# EAGLE design AJH_module_tester-v02_11 (EAGLE 9.5.2)

## Sheet 1 of 4
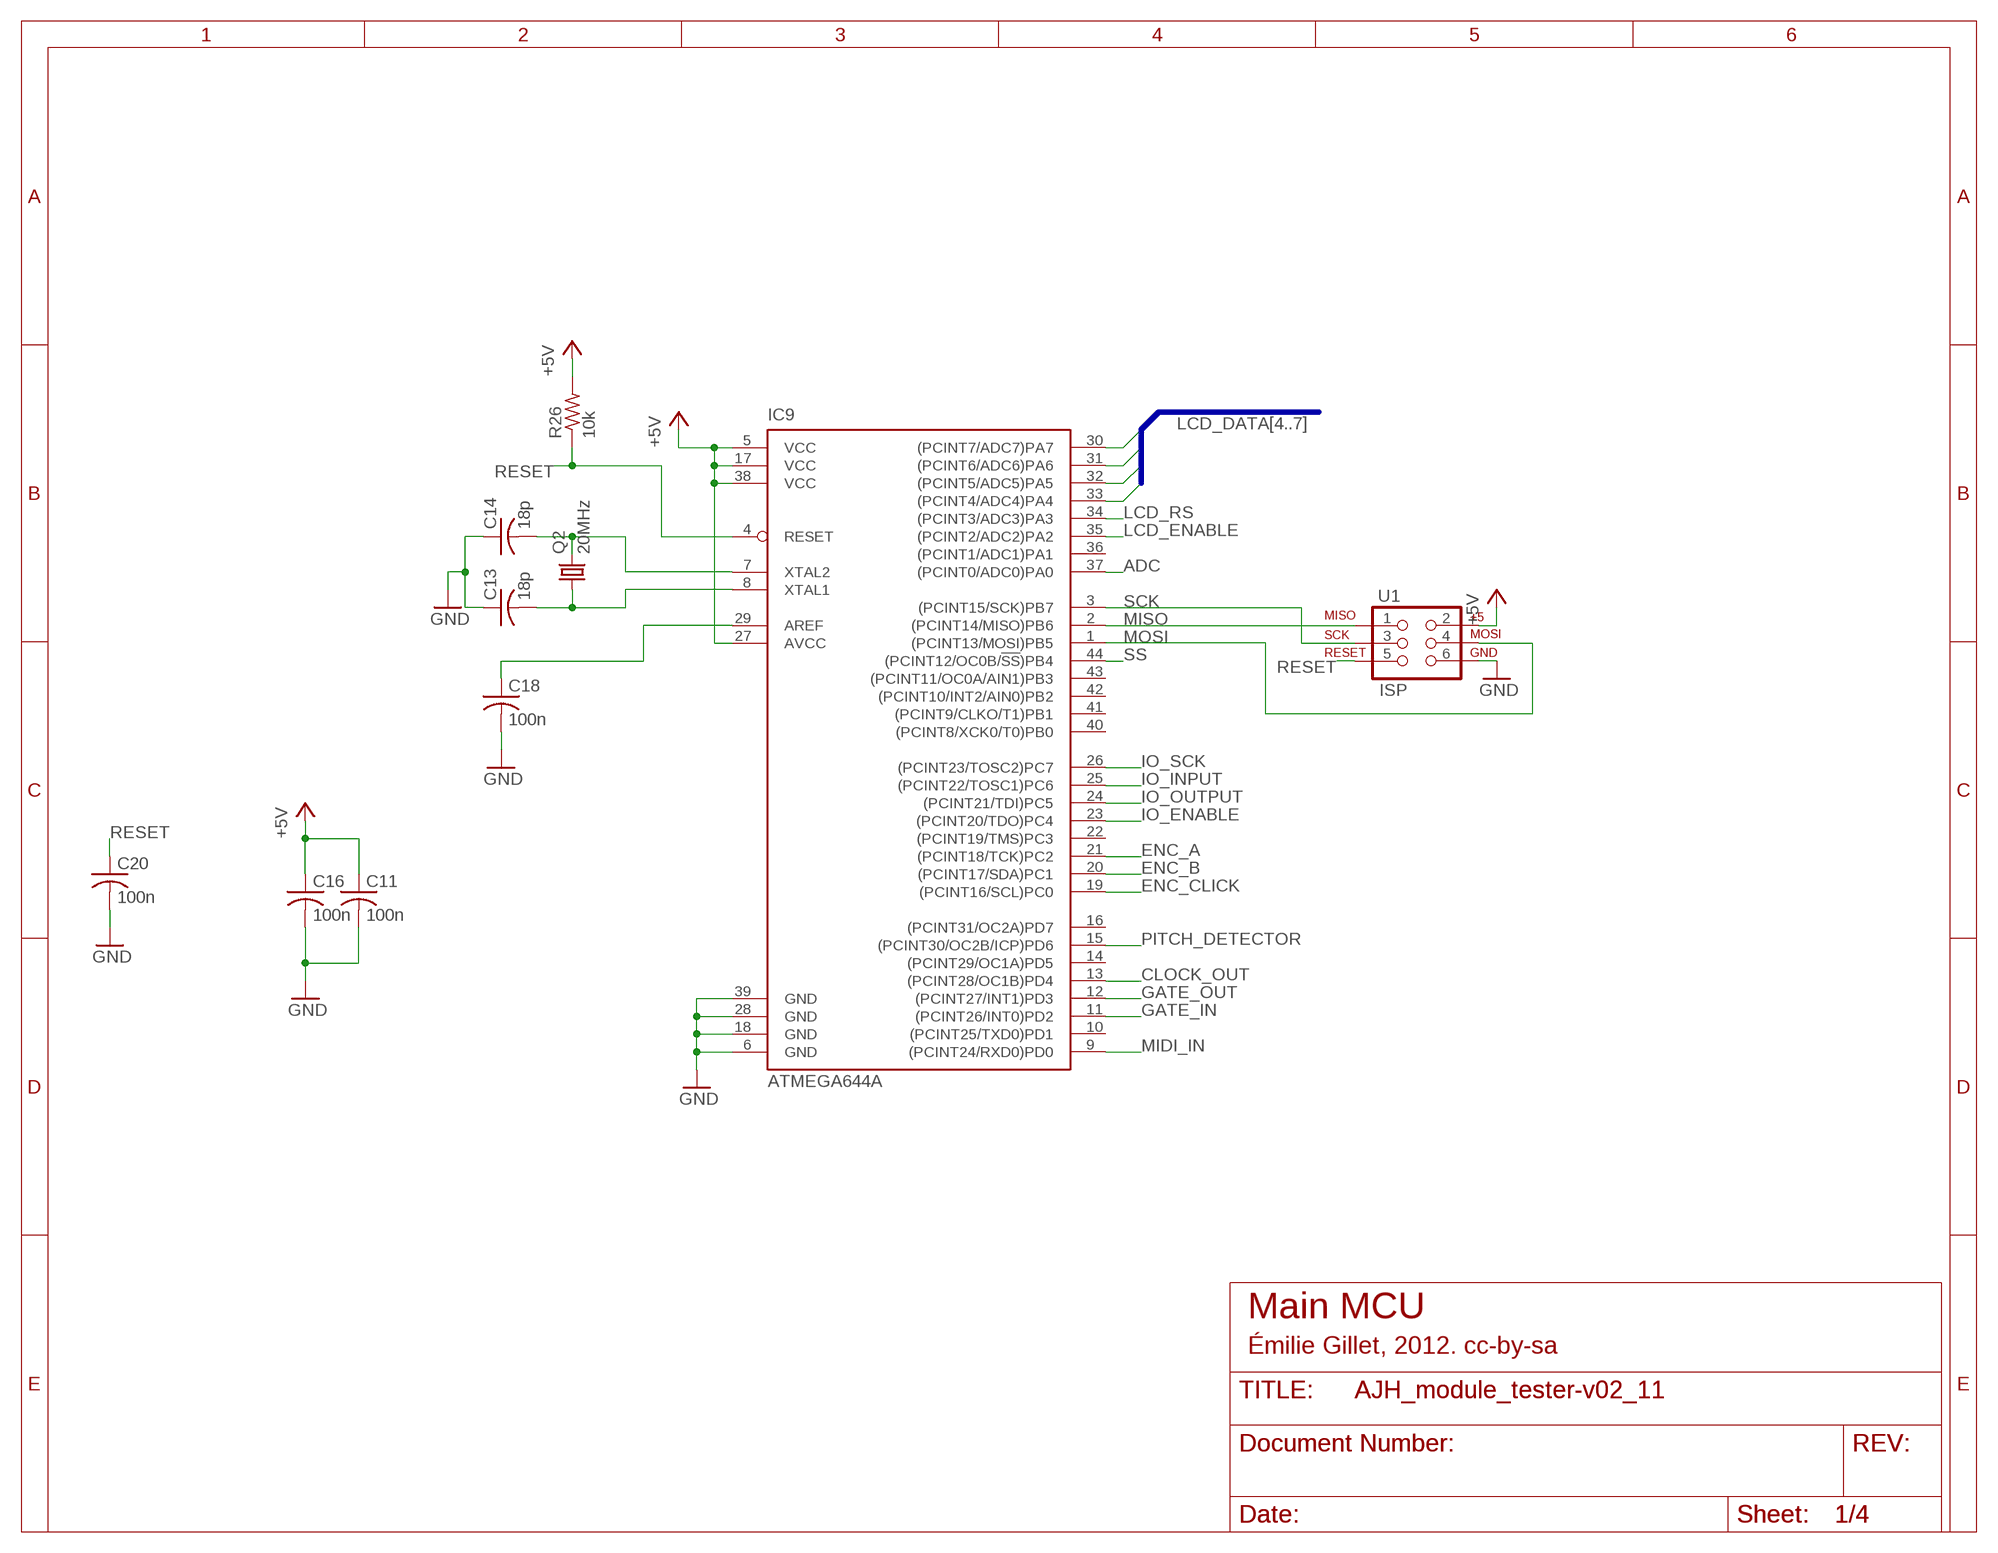
[diagram p0: schematic, sheet 1]

### Parts
C11  100n  C-USC0603  [C0603]
C13  18p  C-USC0603  [C0603]
C14  18p  C-USC0603  [C0603]
C16  100n  C-USC0603  [C0603]
C18  100n  C-USC0603  [C0603]
C20  100n  C-USC0603  [C0603]
IC9  ATMEGA644A  [TQFP44]
Q2  20MHz  CRYSTALHC49UP  [HC49UP]
R26  10k  R-US_R0603  [R0603]
U1  ISP  AVR_SPI_PRG_6PTH  [2X3]

### Nets
+5V: C11.1 C16.1 IC9.5(VCC) IC9.17(VCC) IC9.27(AVCC) IC9.38(VCC) R26.2 U1.2 ; also sheet 2,3,4
ADC: IC9.37((PCINT0/ADC0)PA0) ; also sheet 3
CLOCK_OUT: IC9.13((PCINT28/OC1B)PD4) ; also sheet 2
ENC_A: IC9.21((PCINT18/TCK)PC2) ; also sheet 2
ENC_B: IC9.20((PCINT17/SDA)PC1) ; also sheet 2
ENC_CLICK: IC9.19((PCINT16/SCL)PC0) ; also sheet 2
GATE_IN: IC9.11((PCINT26/INT0)PD2) ; also sheet 2
GATE_OUT: IC9.12((PCINT27/INT1)PD3) ; also sheet 2
GND: C11.2 C13.1 C14.1 C16.2 C18.2 C20.2 IC9.6(GND) IC9.18(GND) IC9.28(GND) IC9.39(GND) U1.6 ; also sheet 2,3,4
IO_ENABLE: IC9.23((PCINT20/TDO)PC4) ; also sheet 2
IO_INPUT: IC9.25((PCINT22/TOSC1)PC6) ; also sheet 2
IO_OUTPUT: IC9.24((PCINT21/TDI)PC5) ; also sheet 2
IO_SCK: IC9.26((PCINT23/TOSC2)PC7) ; also sheet 2
LCD_DATA4: IC9.33((PCINT4/ADC4)PA4) ; also sheet 2
LCD_DATA5: IC9.32((PCINT5/ADC5)PA5) ; also sheet 2
LCD_DATA6: IC9.31((PCINT6/ADC6)PA6) ; also sheet 2
LCD_DATA7: IC9.30((PCINT7/ADC7)PA7) ; also sheet 2
LCD_ENABLE: IC9.35((PCINT2/ADC2)PA2) ; also sheet 2
LCD_RS: IC9.34((PCINT3/ADC3)PA3) ; also sheet 2
MIDI_IN: IC9.9((PCINT24/RXD0)PD0) ; also sheet 2
MISO: IC9.2((PCINT14/MISO)PB6) U1.1
MOSI: IC9.1((PCINT13/MOSI)PB5) U1.4 ; also sheet 3
N$4: C13.2 IC9.8(XTAL1) Q2.1
N$20: C14.2 IC9.7(XTAL2) Q2.2
N$22: C18.1 IC9.29(AREF)
PITCH_DETECTOR: IC9.15((PCINT30/OC2B/ICP)PD6) ; also sheet 3
RESET: C20.1 IC9.4(RESET) R26.1 U1.5
SCK: IC9.3((PCINT15/SCK)PB7) U1.3 ; also sheet 3
SS: IC9.44((PCINT12/OC0B/!SS!)PB4) ; also sheet 3
Unconnected: IC9.10((PCINT25/TXD0)PD1) IC9.14((PCINT29/OC1A)PD5) IC9.16((PCINT31/OC2A)PD7) IC9.22((PCINT19/TMS)PC3) IC9.36((PCINT1/ADC1)PA1) IC9.40((PCINT8/XCK0/T0)PB0) IC9.41((PCINT9/CLKO/T1)PB1) IC9.42((PCINT10/INT2/AIN0)PB2) IC9.43((PCINT11/OC0A/AIN1)PB3)

### Buses
LCD_DATA[4..7]

### Notes on the sheet
- Main MCU
- Émilie Gillet, 2012. cc-by-sa

## Sheet 2 of 4
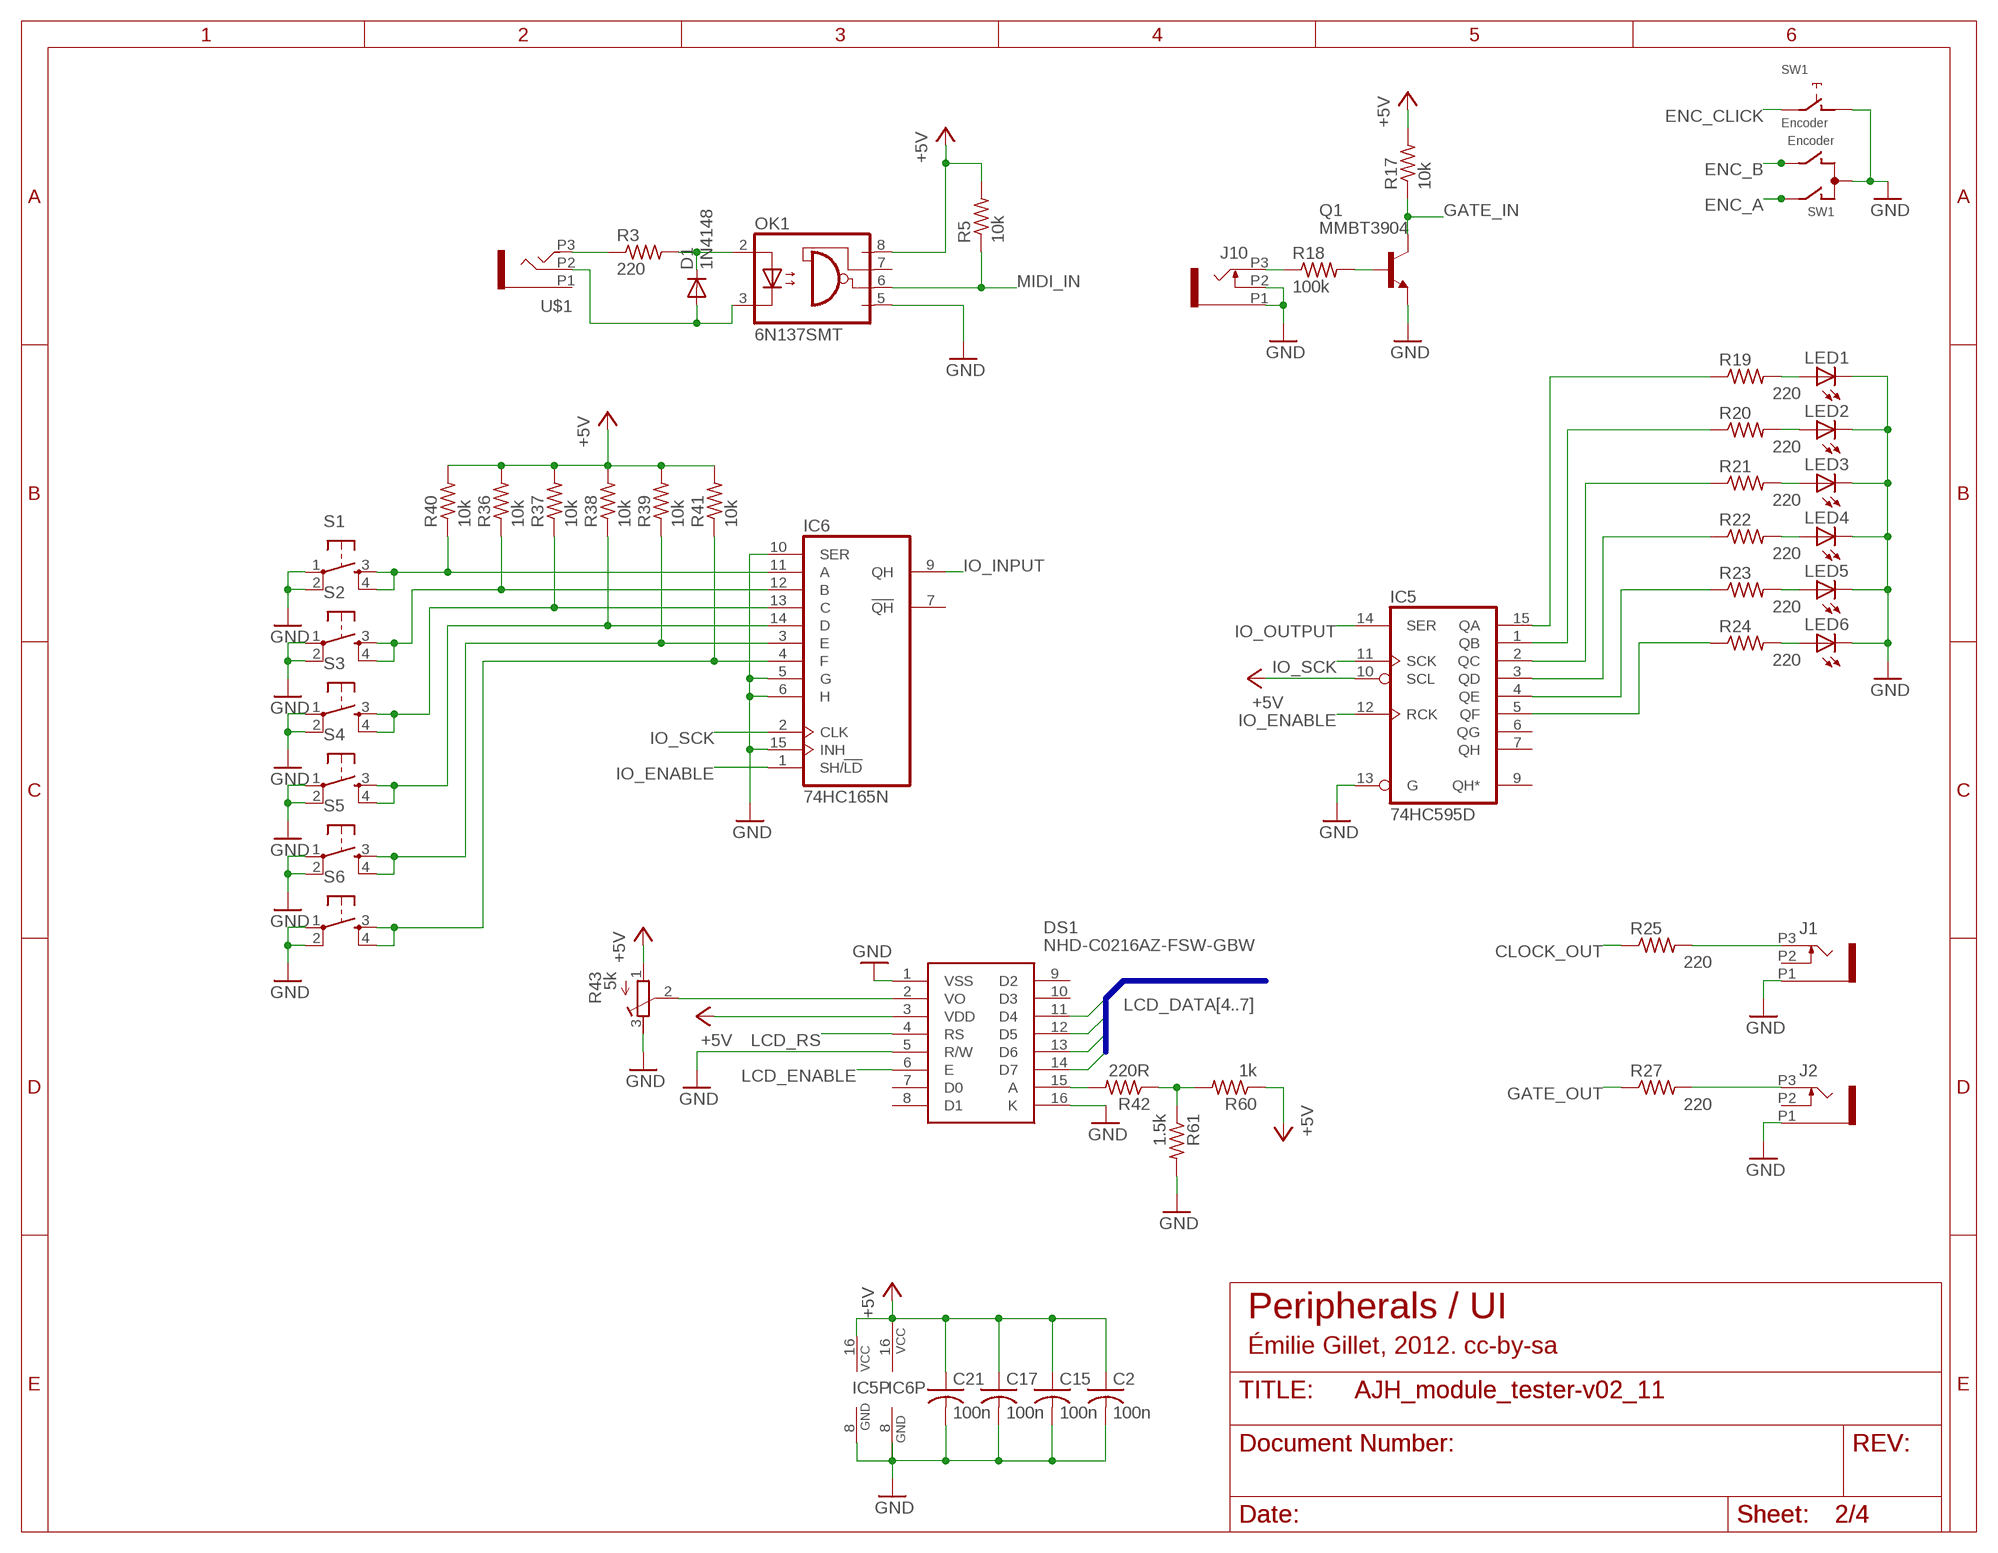
[diagram p1: schematic, sheet 2]

### Parts
C2  100n  C-USC0603  [C0603]
C15  100n  C-USC0603  [C0603]
C17  100n  C-USC0603  [C0603]
C21  100n  C-USC0603  [C0603]
D1  1N4148  DIODE-SOD123  [SOD123]
DS1  NHD-C0216AZ-FSW-GBW  [NHDC0216AZFSWGBW]
IC5  74HC595D  [SO16]
IC6  74HC165N  74LS165D  [SO16]
J1  PJ301_THONKICONN6  [WQP_PJ_301M6]
J2  PJ301_THONKICONN6  [WQP_PJ_301M6]
J10  PJ301_THONKICONN6  [WQP_PJ_301M6]
LED1  LED3MM  [LED3MM]
LED2  LED3MM  [LED3MM]
LED3  LED3MM  [LED3MM]
LED4  LED3MM  [LED3MM]
LED5  LED3MM  [LED3MM]
LED6  LED3MM  [LED3MM]
OK1  6N137SMT  [DIL8-SMD]
Q1  MMBT3904  MMBT3904LT1-NPN-SOT23-BEC  [SOT23-BEC]
R3  220  R-US_R0603  [R0603]
R5  10k  R-US_R0603  [R0603]
R17  10k  R-US_R0603  [R0603]
R18  100k  R-US_R0603  [R0603]
R19  220  R-US_R0603  [R0603]
R20  220  R-US_R0603  [R0603]
R21  220  R-US_R0603  [R0603]
R22  220  R-US_R0603  [R0603]
R23  220  R-US_R0603  [R0603]
R24  220  R-US_R0603  [R0603]
R25  220  R-US_R0603  [R0603]
R27  220  R-US_R0603  [R0603]
R36  10k  R-US_R0603  [R0603]
R37  10k  R-US_R0603  [R0603]
R38  10k  R-US_R0603  [R0603]
R39  10k  R-US_R0603  [R0603]
R40  10k  R-US_R0603  [R0603]
R41  10k  R-US_R0603  [R0603]
R42  220R  R-US_R0603  [R0603]
R43  5k  R-TRIMM3339P  [RTRIM3339P]
R60  1k  R-US_R0603  [R0603]
R61  1.5k  R-US_R0603  [R0603]
S1  TAC_SWITCHPTH  [TACTILE-PTH]
S2  TAC_SWITCHPTH  [TACTILE-PTH]
S3  TAC_SWITCHPTH  [TACTILE-PTH]
S4  TAC_SWITCHPTH  [TACTILE-PTH]
S5  TAC_SWITCHPTH  [TACTILE-PTH]
S6  TAC_SWITCHPTH  [TACTILE-PTH]
SW1  Encoder  EC12E_SW  [ALPS_EC12E_SW]
U$1  PJ366ST  [WQP_PJ_301M8]

### Nets
+5V: C2.1 C15.1 C17.1 C21.1 DS1.3(VDD) IC5.10(SCL) IC5.16(VCC) IC6.16(VCC) OK1.8(VCC) R5.2 R17.2 R36.2 R37.2 R38.2 R39.2 R40.2 R41.2 R43.1(E) R60.1 ; also sheet 1,3,4
CLOCK_OUT: R25.1 ; also sheet 1
ENC_A: SW1.A ; also sheet 1
ENC_B: SW1.B ; also sheet 1
ENC_CLICK: SW1.E ; also sheet 1
GATE_IN: Q1.C R17.1 ; also sheet 1
GATE_OUT: R27.1 ; also sheet 1
GND: C2.2 C15.2 C17.2 C21.2 DS1.1(VSS) DS1.5(R/W) DS1.16(K) IC5.8(GND) IC5.13(G) IC6.5(G) IC6.6(H) IC6.8(GND) IC6.10(SER) IC6.15(INH) J1.P1 J2.P1 J10.P1 J10.P2 LED1.K(C) LED2.K(C) LED3.K(C) LED4.K(C) LED5.K(C) LED6.K(C) OK1.5(GND) Q1.E R43.3(A) R61.2 S1.1 S1.2 S2.1 S2.2 S3.1 S3.2 S4.1 S4.2 S5.1 S5.2 S6.1 S6.2 SW1.C SW1.D ; also sheet 1,3,4
IO_ENABLE: IC5.12(RCK) IC6.1(SH/!LD) ; also sheet 1
IO_INPUT: IC6.9(QH) ; also sheet 1
IO_OUTPUT: IC5.14(SER) ; also sheet 1
IO_SCK: IC5.11(SCK) IC6.2(CLK) ; also sheet 1
LCD_DATA4: DS1.11(D4) ; also sheet 1
LCD_DATA5: DS1.12(D5) ; also sheet 1
LCD_DATA6: DS1.13(D6) ; also sheet 1
LCD_DATA7: DS1.14(D7) ; also sheet 1
LCD_ENABLE: DS1.6(E) ; also sheet 1
LCD_RS: DS1.4(RS) ; also sheet 1
MIDI_IN: OK1.6(VO) R5.1 ; also sheet 1
N$1: IC5.2(QC) R21.1
N$2: IC5.4(QE) R23.1
N$3: LED5.A R23.2
N$5: J10.P3 R18.1
N$7: R3.1 U$1.P3
N$9: IC6.3(E) R39.1 S5.3 S5.4
N$11: J1.P3 R25.2
N$12: IC6.4(F) R41.1 S6.3 S6.4
N$13: IC6.14(D) R38.1 S4.3 S4.4
N$14: J2.P3 R27.2
N$19: LED6.A R24.2
N$21: IC5.5(QF) R24.1
N$24: IC6.11(A) R40.1 S1.3 S1.4
N$25: DS1.15(A) R42.2
N$28: D1.C OK1.2(A) R3.2
N$30: IC5.15(QA) R19.1
N$31: IC5.1(QB) R20.1
N$33: IC5.3(QD) R22.1
N$34: DS1.2(VO) R43.2(S)
N$42: LED1.A R19.2
N$43: LED2.A R20.2
N$44: LED3.A R21.2
N$45: LED4.A R22.2
N$60: R42.1 R60.2 R61.1
N$66: Q1.B R18.2
N$73: D1.A OK1.3(C) U$1.P2
N$88: IC6.12(B) R36.1 S2.3 S2.4
N$90: IC6.13(C) R37.1 S3.3 S3.4
Unconnected: DS1.7(D0) DS1.8(D1) DS1.9(D2) DS1.10(D3) IC5.6(QG) IC5.7(QH) IC5.9(QH*) IC6.7(!QH) J1.P2 J2.P2 OK1.7(VE) SW1.GND1(G) SW1.GND2(G) U$1.P1

### Buses
LCD_DATA[4..7]

### Notes on the sheet
- Peripherals / UI
- Émilie Gillet, 2012. cc-by-sa

## Sheet 3 of 4
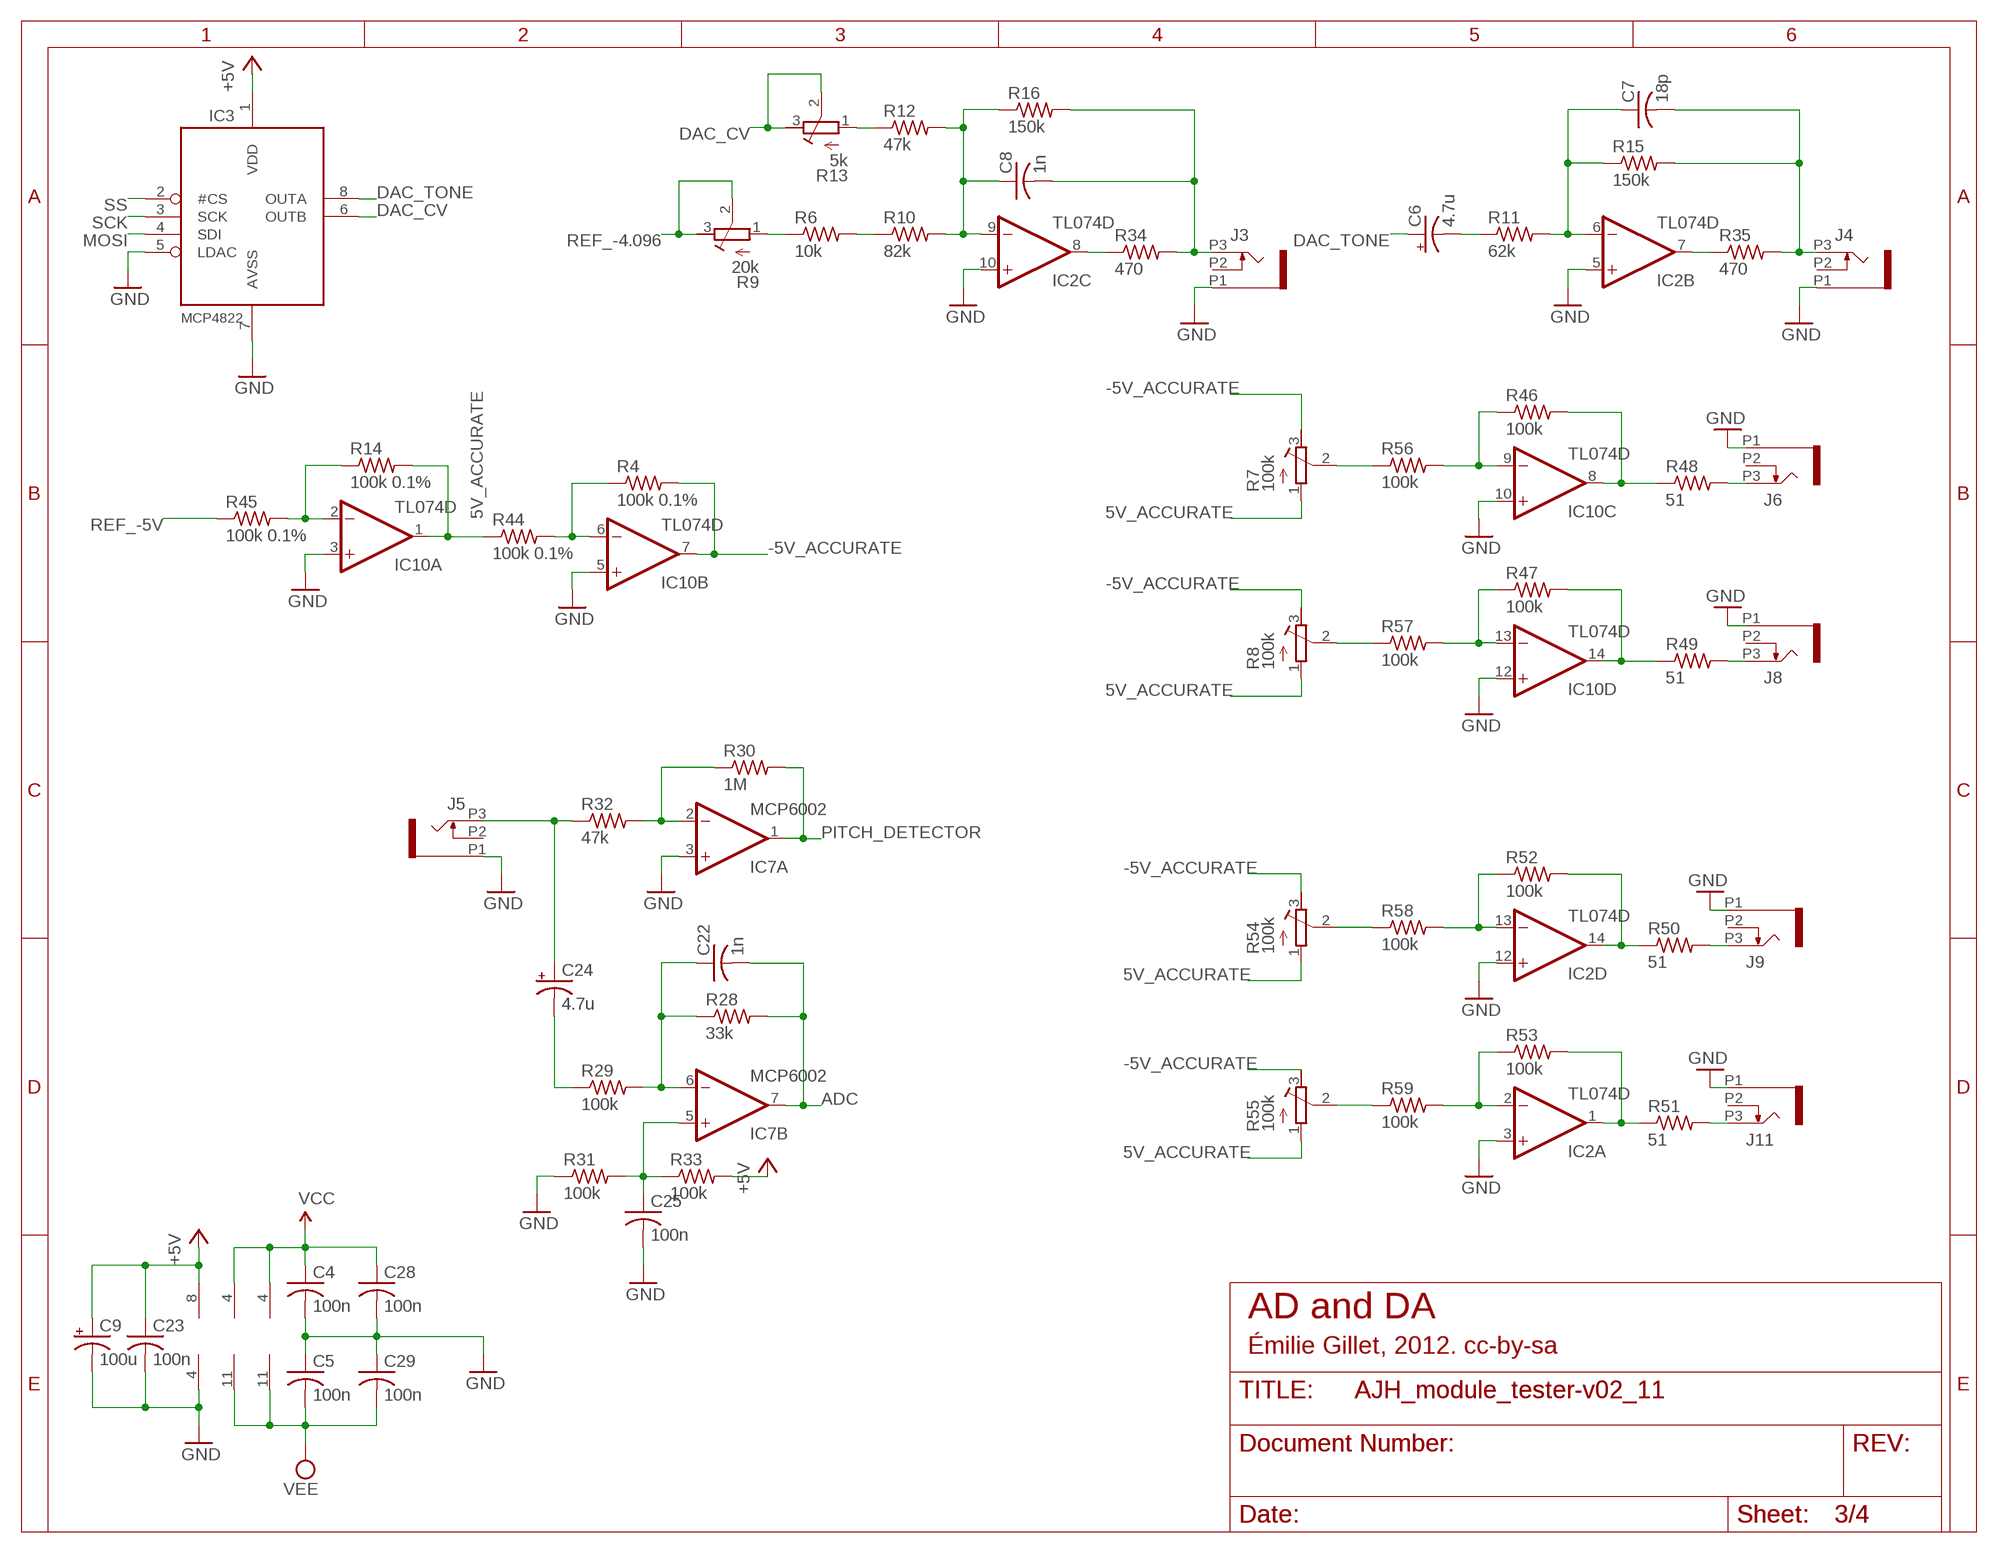
[diagram p2: schematic, sheet 3]

### Parts
C4  100n  C-USC0603  [C0603]
C5  100n  C-USC0603  [C0603]
C6  4.7u  CPOL-USA  [PANASONIC_A]
C7  18p  C-USC0603  [C0603]
C8  1n  C-USC0603  [C0603]
C9  100u  CPOL-USA  [PANASONIC_A]
C22  1n  C-USC0603  [C0603]
C23  100n  C-USC0603  [C0603]
C24  4.7u  CPOL-USA  [PANASONIC_A]
C25  100n  C-USC0603  [C0603]
C28  100n  C-USC0603  [C0603]
C29  100n  C-USC0603  [C0603]
IC2  TL074D  [SO14]
IC3  MCP4822SO08  [SO08]
IC7  MCP6002  TL072D  [SO08]
IC10  TL074D  [SO14]
J3  PJ301_THONKICONN6  [WQP_PJ_301M6]
J4  PJ301_THONKICONN6  [WQP_PJ_301M6]
J5  PJ301_THONKICONN6  [WQP_PJ_301M6]
J6  PJ301_THONKICONN6  [WQP_PJ_301M6]
J8  PJ301_THONKICONN6  [WQP_PJ_301M6]
J9  PJ301_THONKICONN6  [WQP_PJ_301M6]
J11  PJ301_THONKICONN6  [WQP_PJ_301M6]
R4  100k 0.1%  R-US_R0603  [R0603]
R6  10k  R-US_R0603  [R0603]
R7  100k  R-TRIMM3296W  [RTRIM3296W]
R8  100k  R-TRIMM3296W  [RTRIM3296W]
R9  20k  R-TRIMM3296W  [RTRIM3296W]
R10  82k  R-US_R0603  [R0603]
R11  62k  R-US_R0603  [R0603]
R12  47k  R-US_R0603  [R0603]
R13  5k  R-TRIMM3296W  [RTRIM3296W]
R14  100k 0.1%  R-US_R0603  [R0603]
R15  150k  R-US_R0603  [R0603]
R16  150k  R-US_R0603  [R0603]
R28  33k  R-US_R0603  [R0603]
R29  100k  R-US_R0603  [R0603]
R30  1M  R-US_R0603  [R0603]
R31  100k  R-US_R0603  [R0603]
R32  47k  R-US_R0603  [R0603]
R33  100k  R-US_R0603  [R0603]
R34  470  R-US_R0603  [R0603]
R35  470  R-US_R0603  [R0603]
R44  100k 0.1%  R-US_R0603  [R0603]
R45  100k 0.1%  R-US_R0603  [R0603]
R46  100k  R-US_R0603  [R0603]
R47  100k  R-US_R0603  [R0603]
R48  51  R-US_R0603  [R0603]
R49  51  R-US_R0603  [R0603]
R50  51  R-US_R0603  [R0603]
R51  51  R-US_R0603  [R0603]
R52  100k  R-US_R0603  [R0603]
R53  100k  R-US_R0603  [R0603]
R54  100k  R-TRIMM3296W  [RTRIM3296W]
R55  100k  R-TRIMM3296W  [RTRIM3296W]
R56  100k  R-US_R0603  [R0603]
R57  100k  R-US_R0603  [R0603]
R58  100k  R-US_R0603  [R0603]
R59  100k  R-US_R0603  [R0603]

### Nets
5V_ACCURATE: IC10.1(A:OUT) R7.1(E) R8.1(E) R14.2 R44.1 R54.1(E) R55.1(E)
+5V: C9.+ C23.1 IC3.1(VDD) IC7.8(P:V+) R33.2 ; also sheet 1,2,4
-5V_ACCURATE: IC10.7(B:OUT) R4.2 R7.3(A) R8.3(A) R54.3(A) R55.3(A)
ADC: C22.2 IC7.7(B:OUT) R28.2 ; also sheet 1
DAC_CV: IC3.6(OUTB) R13.2(S) R13.3(A)
DAC_TONE: C6.+ IC3.8(OUTA)
GND: C4.2 C5.1 C9.- C23.2 C25.2 C28.2 C29.1 IC2.3(A:+IN) IC2.5(B:+IN) IC2.10(C:+IN) IC2.12(D:+IN) IC3.5(LDAC) IC3.7(AVSS) IC7.3(A:+IN) IC7.4(P:V-) IC10.3(A:+IN) IC10.5(B:+IN) IC10.10(C:+IN) IC10.12(D:+IN) J3.P1 J4.P1 J5.P1 J6.P1 J8.P1 J9.P1 J11.P1 R31.1 ; also sheet 1,2,4
MOSI: IC3.4(SDI) ; also sheet 1
N$6: C24.+ J5.P3 R32.1
N$8: IC2.8(C:OUT) R34.1
N$10: IC2.7(B:OUT) R35.1
N$15: IC2.2(A:-IN) R53.1 R59.2
N$16: J8.P3 R49.2
N$17: C6.- R11.1
N$18: J6.P3 R48.2
N$23: C7.1 IC2.6(B:-IN) R11.2 R15.1
N$26: C8.2 J3.P3 R16.2 R34.2
N$27: C8.1 IC2.9(C:-IN) R10.2 R12.2 R16.1
N$29: R12.1 R13.1(E)
N$32: R6.1 R9.1(E)
N$35: R6.2 R10.1
N$36: C25.1 IC7.5(B:+IN) R31.2 R33.1
N$37: IC7.2(A:-IN) R30.1 R32.2
N$38: C22.1 IC7.6(B:-IN) R28.1 R29.2
N$39: IC10.14(D:OUT) R47.2 R49.1
N$40: C24.- R29.1
N$41: IC2.14(D:OUT) R50.1 R52.2
N$46: IC10.9(C:-IN) R46.1 R56.2
N$47: IC10.8(C:OUT) R46.2 R48.1
N$48: IC10.13(D:-IN) R47.1 R57.2
N$49: IC10.2(A:-IN) R14.1 R45.2
N$50: IC10.6(B:-IN) R4.1 R44.2
N$51: IC2.13(D:-IN) R52.1 R58.2
N$52: R7.2(S) R56.1
N$53: J9.P3 R50.2
N$54: J11.P3 R51.2
N$55: IC2.1(A:OUT) R51.1 R53.2
N$57: R8.2(S) R57.1
N$58: R55.2(S) R59.1
N$59: R54.2(S) R58.1
PITCH_DETECTOR: IC7.1(A:OUT) R30.2 ; also sheet 1
REF_-4.096: R9.2(S) R9.3(A) ; also sheet 4
REF_-5V: R45.1 ; also sheet 4
SCK: IC3.3(SCK) ; also sheet 1
SS: IC3.2(#CS) ; also sheet 1
TONE_OUT: C7.2 J4.P3 R15.2 R35.2
VCC: C4.1 C28.1 IC2.4(P:V+) IC10.4(P:V+) ; also sheet 4
VEE: C5.2 C29.2 IC2.11(P:V-) IC10.11(P:V-) ; also sheet 4
Unconnected: J3.P2 J4.P2 J5.P2 J6.P2 J8.P2 J9.P2 J11.P2

### Notes on the sheet
- AD and DA
- Émilie Gillet, 2012. cc-by-sa

## Sheet 4 of 4
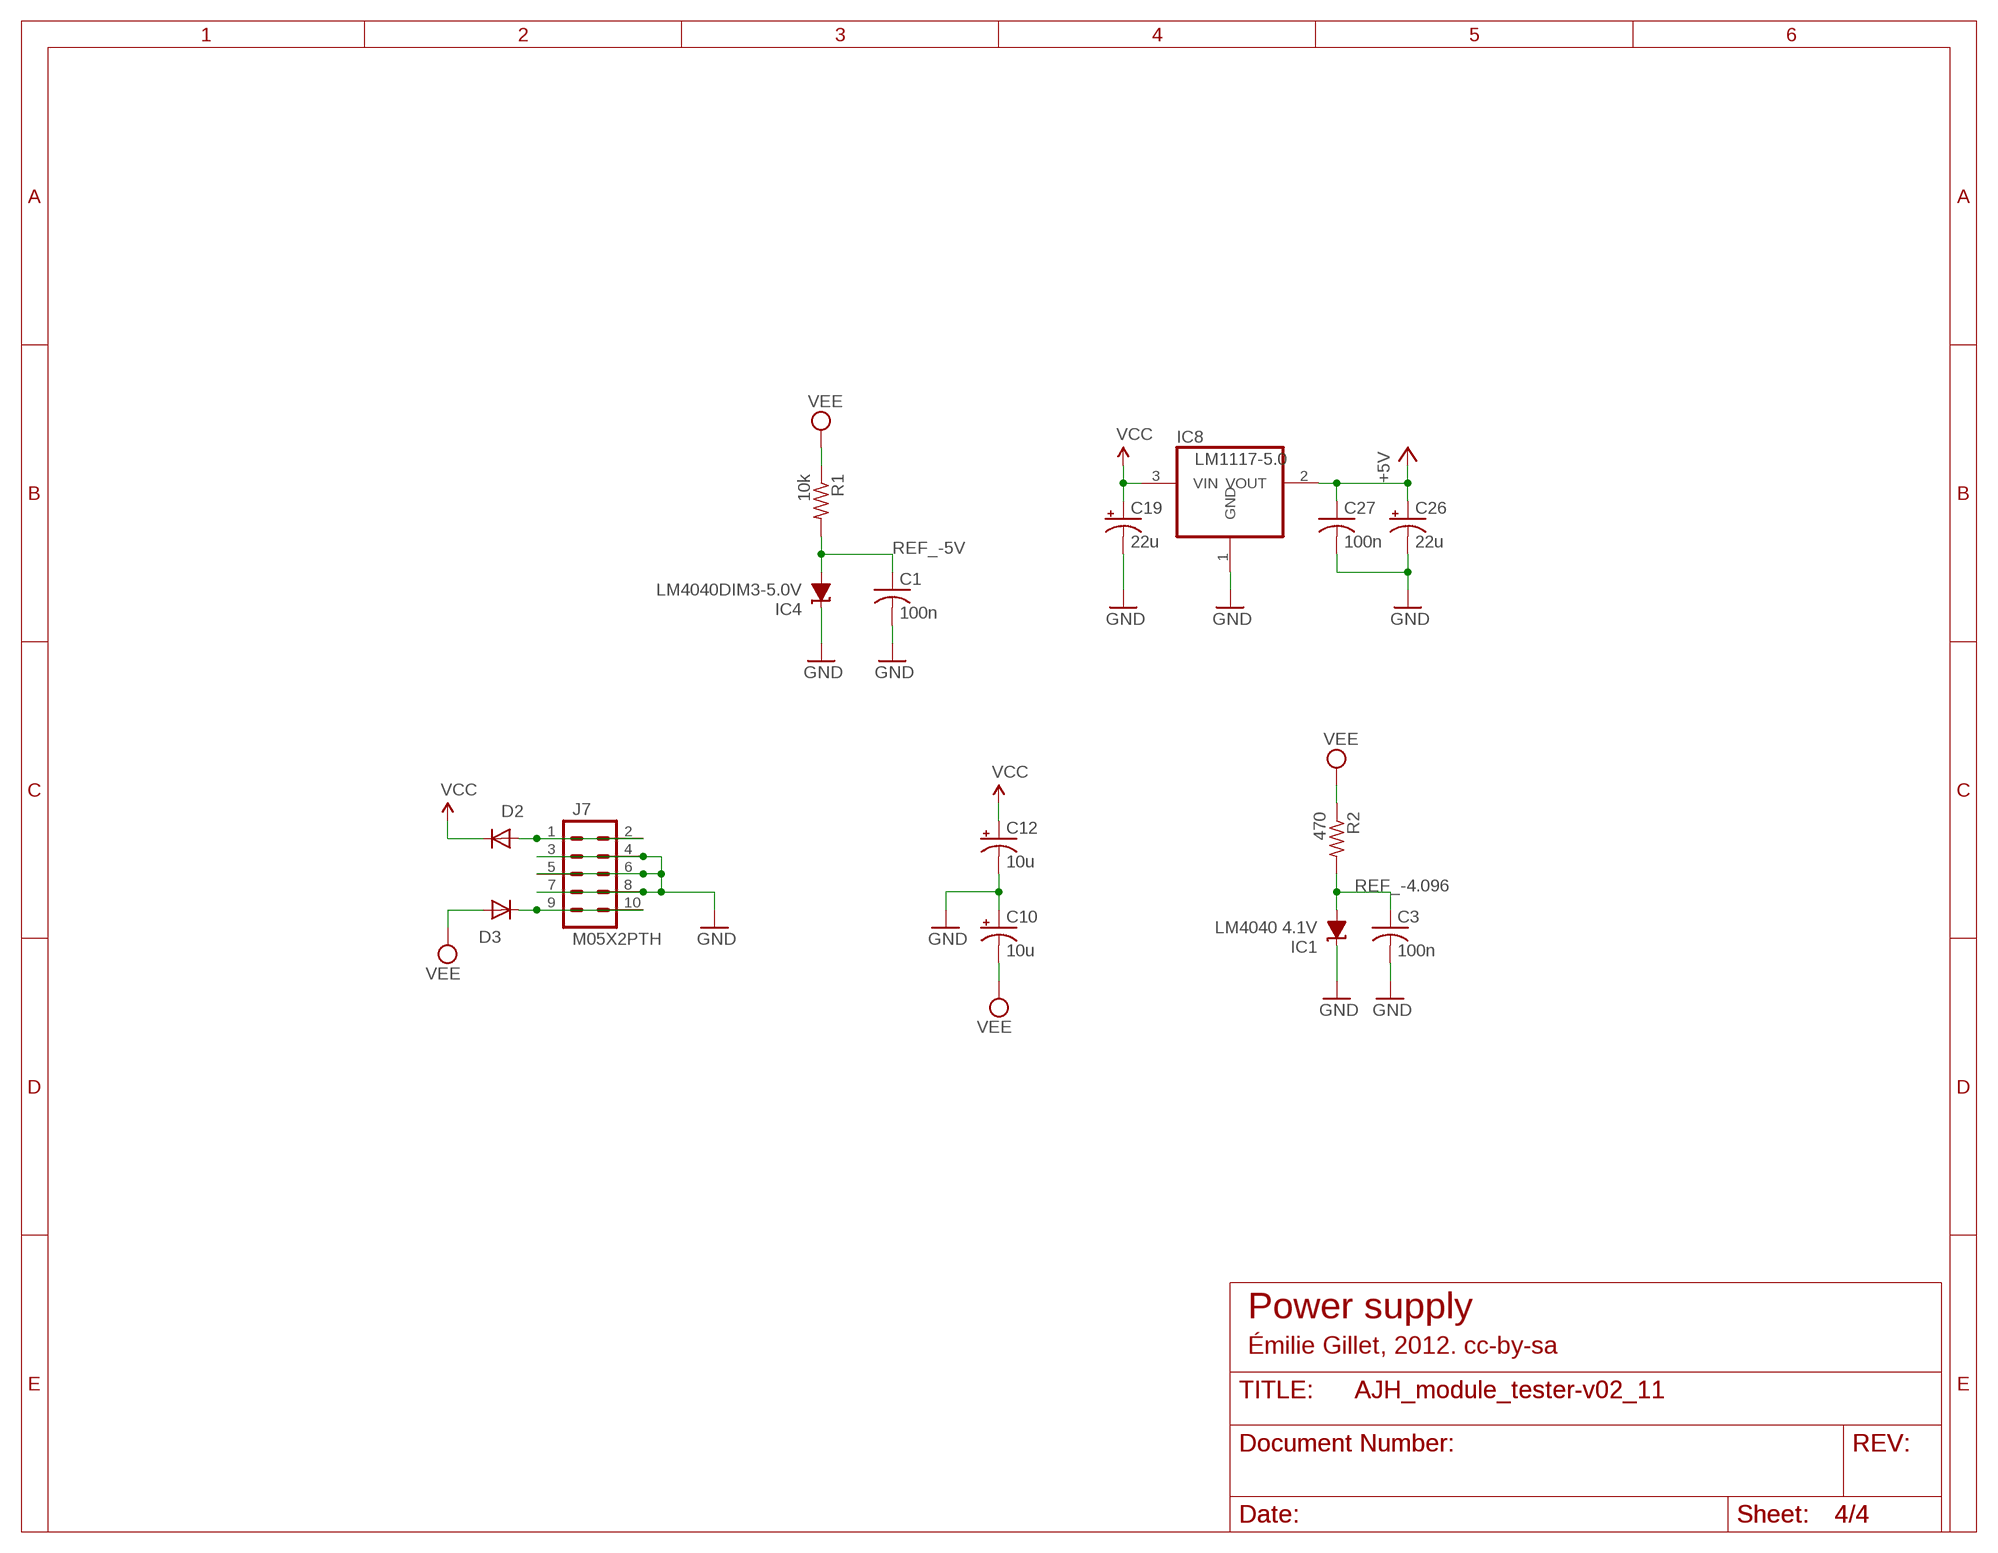
[diagram p3: schematic, sheet 4]

### Parts
C1  100n  C-USC0603  [C0603]
C3  100n  C-USC0603  [C0603]
C10  10u  CPOL-USA  [PANASONIC_A]
C12  10u  CPOL-USA  [PANASONIC_A]
C19  22u  CPOL-USC  [PANASONIC_C]
C26  22u  CPOL-USC  [PANASONIC_C]
C27  100n  C-USC0603  [C0603]
D2  1N5819HW  DIODE-SOD123  [SOD123]
D3  1N5819HW  DIODE-SOD123  [SOD123]
IC1  LM4040 4.1V  LM4041C12DBZ  [DBZ_R-PDSO-G3]
IC4  LM4040DIM3-5.0V  LM4041C12DBZ  [DBZ_R-PDSO-G3]
IC8  LM1117-5.0  REG1117  [SOT223]
J7  M05X2PTH  [AVR_ICSP]
R1  10k  R-US_R0603  [R0603]
R2  470  R-US_R0603  [R0603]

### Nets
+5V: C26.+ C27.1 IC8.2(VOUT) ; also sheet 1,2,3
GND: C1.2 C3.2 C10.+ C12.- C19.- C26.- C27.2 IC1.1(C) IC4.1(C) IC8.1(GND) J7.3 J7.4 J7.5 J7.6 J7.7 J7.8 ; also sheet 1,2,3
N$56: D2.A J7.1 J7.2
N$64: D3.C J7.9 J7.10
REF_-4.096: C3.1 IC1.2(A) R2.2 ; also sheet 3
REF_-5V: C1.1 IC4.2(A) R1.2 ; also sheet 3
VCC: C12.+ C19.+ D2.C IC8.3(VIN) ; also sheet 3
VEE: C10.- D3.A R1.1 R2.1 ; also sheet 3

### Notes on the sheet
- Power supply
- Émilie Gillet, 2012. cc-by-sa

## Library data of the parts
C1-C5 C7 C8 C11 C13-C18 C20-C23 C25 C27-C29 = rcl:C-US: CAPACITOR, American symbol
C6 C9 C10 C12 C19 C24 C26 = rcl:CPOL-US: POLARIZED CAPACITOR, American symbol
D1-D3 = diode:DIODE-: DIODE
DS1 = NHD-C0216AZ-FSW-GBW:NHD-C0216AZ-FSW-GBW: LCD Character Display Modules & Accessories STN-GRAY Transfl 54.7 x 25.3 x 5.5 Source: Datasheet <https://componentsearchengine.com/Datasheets/1/NHD-C0216AZ-FSW-GBW.pdf>; DESCRIPTION: LCD Character Display Modules & Accessories STN-GRAY Transfl 54.7 x 25.3 x 5.5; HEIGHT: 5mm; MANUFACTURER_NAME: Newhaven Display; MANUFACTURER_PART_NUMBER: NHD-C0216AZ-FSW-GBW; MOUSER_PART_NUMBER: 763-C0216AZ-FSW-GBW; MOUSER_PRICE-STOCK: https://www.mouser.com/Search/Refine.aspx?Keyword=763-C0216AZ-FSW-GBW
IC1 IC4 = texas:LM4041: PRECISION MICROPOWER SHUNT VOLTAGE REFERENCE Source: http://focus.ti.com/lit/ds/slcs146e/slcs146e.pdf
IC2 IC10 = linear:TL074: OP AMP
IC3 = og-dac:MCP4822
IC5 = 74xx-eu:74*595: 8-bit SHIFT REGISTER, output latch
IC6 = 74xx-us:74*165: 8-bit parallel load SHIFT REGISTER
IC7 = og-linear:TL072: OP AMP
IC8 = og-vreg:REG1117: 800mA and 1A Low Dropout (LDO) Positive Regulator 1.8V, 2.5V, 2.85V, 3.3V, 5V, and Adj
IC9 = atmel:ATMEGA644: 8-bit Microcontroller with 64K Bytes In-System Programmable Flash Source: http://www.atmel.com/dyn/resources/prod_documents/doc2593.pdf; MPN: ATMEGA644PV-10AU; OC_FARNELL: 1455123; OC_NEWARK: 58M3748
J1-J6 J8-J11 = og-pj301:PJ301_THONKICONN
J7 = og-header:M05X2: Header 5x2 Standard 10-pin dual row 0.1" header. Commonly used with AVR-ISP. Use with Spark Fun Electronics SKU: PRT-00778
LED1-LED6 = led:LED: LED OSRAM: - CHIPLED LG R971, LG N971, LY N971, LG Q971, LY Q971, LO R971, LY R971 LH N974, LH R974 LS Q976, LO Q976, LY Q976 LO Q996 - Hyper CHIPLED LW Q18S LB Q993, LB Q99A, LB R99A - SideLED LS A670, LO A670, LY A670, LG A670, LP A670 LB A673, LV A673, LT A673, LW A673 LH A674 LY A675 LS A676, LA A676, LO A676, LY A676, LW A676 LS A679, LY A679, LG A679 - Hyper Micro SIDELED® LS Y876, LA Y876, LO Y876, LY Y876 LT Y87S - SmartLED LW L88C, LW L88S LB L89C, LB L89S, LG L890 LS L89K, LO L89K, LY L89K LS L896, LA L896, LO L896, LY L896 - TOPLED LS T670, LO T670, LY T670, LG T670, LP T670 LSG T670, LSP T670, LSY T670, LOP T670, LYG T670 LG T671, LOG T671, LSG T671 LB T673, LV T673, LT T673, LW T673 LH T674 LS T676, LA T676, LO T676, LY T676, LB T676, LH T676, LSB T676, LW T676 LB T67C, LV T67C, LT T67C, LS T67K, LO T67K, LY T67K, LW E67C LS E67B, LA E67B, LO E67B, LY E67B, LB E67C, LV E67C, LT E67C LW T67C LS T679, LY T679, LG T679 LS T770, LO T770, LY T770, LG T770, LP T770 LB T773, LV T773, LT T773, LW T773 LH T774 LS E675, LA E675, LY E675, LS T675 LS T776, LA T776, LO T776, LY T776, LB T776 LHGB T686 LT T68C, LB T68C - Hyper Mini TOPLED® LB M676 - Mini TOPLED Santana® LG M470 LS M47K, LO M47K, LY M47K Source: http://www.osram.convergy.de LUXEON: - LUMILED® LXK2-PW12-R00, LXK2-PW12-S00, LXK2-PW14-U00, LXK2-PW14-V00 LXK2-PM12-R00, LXK2-PM12-S00, LXK2-PM14-U00 LXK2-PE12-Q00, LXK2-PE12-R00, LXK2-PE12-S00, LXK2-PE14-T00, LXK2-PE14-U00 LXK2-PB12-K00, LXK2-PB12-L00, LXK2-PB12-M00, LXK2-PB14-N00, LXK2-PB14-P00, LXK2-PB14-Q00 LXK2-PR12-L00, LXK2-PR12-M00, LXK2-PR14-Q00, LXK2-PR14-R00 LXK2-PD12-Q00, LXK2-PD12-R00, LXK2-PD12-S00 LXK2-PH12-R00, LXK2-PH12-S00 LXK2-PL12-P00, LXK2-PL12-Q00, LXK2-PL12-R00 Source: www.luxeon.com KINGBRIGHT: KA-3528ASYC Source: www.kingbright.com
OK1 = og-optocouplers:6N137: MOTOROLA OPTO COUPLER
Q1 = transistor:*-NPN-: NPN Transistror BF959 corrected 2008.03.06
Q2 = crystal:CRYSTAL: CRYSTAL
R1 R2 = resistor:R-US_: RESISTOR, American symbol
R3-R6 R10-R12 R14-R42 R44-R53 R56-R61 = rcl:R-US_: RESISTOR, American symbol
R7-R9 R13 R43 R54 R55 = rcl:R-TRIMM: Trimm resistor
S1-S6 = SparkFun:TAC_SWITCH: Momentary Switch Button commonly used for reset or general input. Spark Fun Electronics SKU : COM-00097
SW1 = switch-alps:EC12E_SW: ALPS rotary Encoder EC12E series with switch
U1 = SparkFun:AVR_SPI_PRG_6: AVR ISP 6 Pin This is the reduced ISP connector for AVR programming. Common on Arduino. This footprint will take up less PCB space and can be used with a 10-pin to 6-pin adapter such as SKU: BOB-08508
U$1 = AJHParts:PJ366ST

## Board
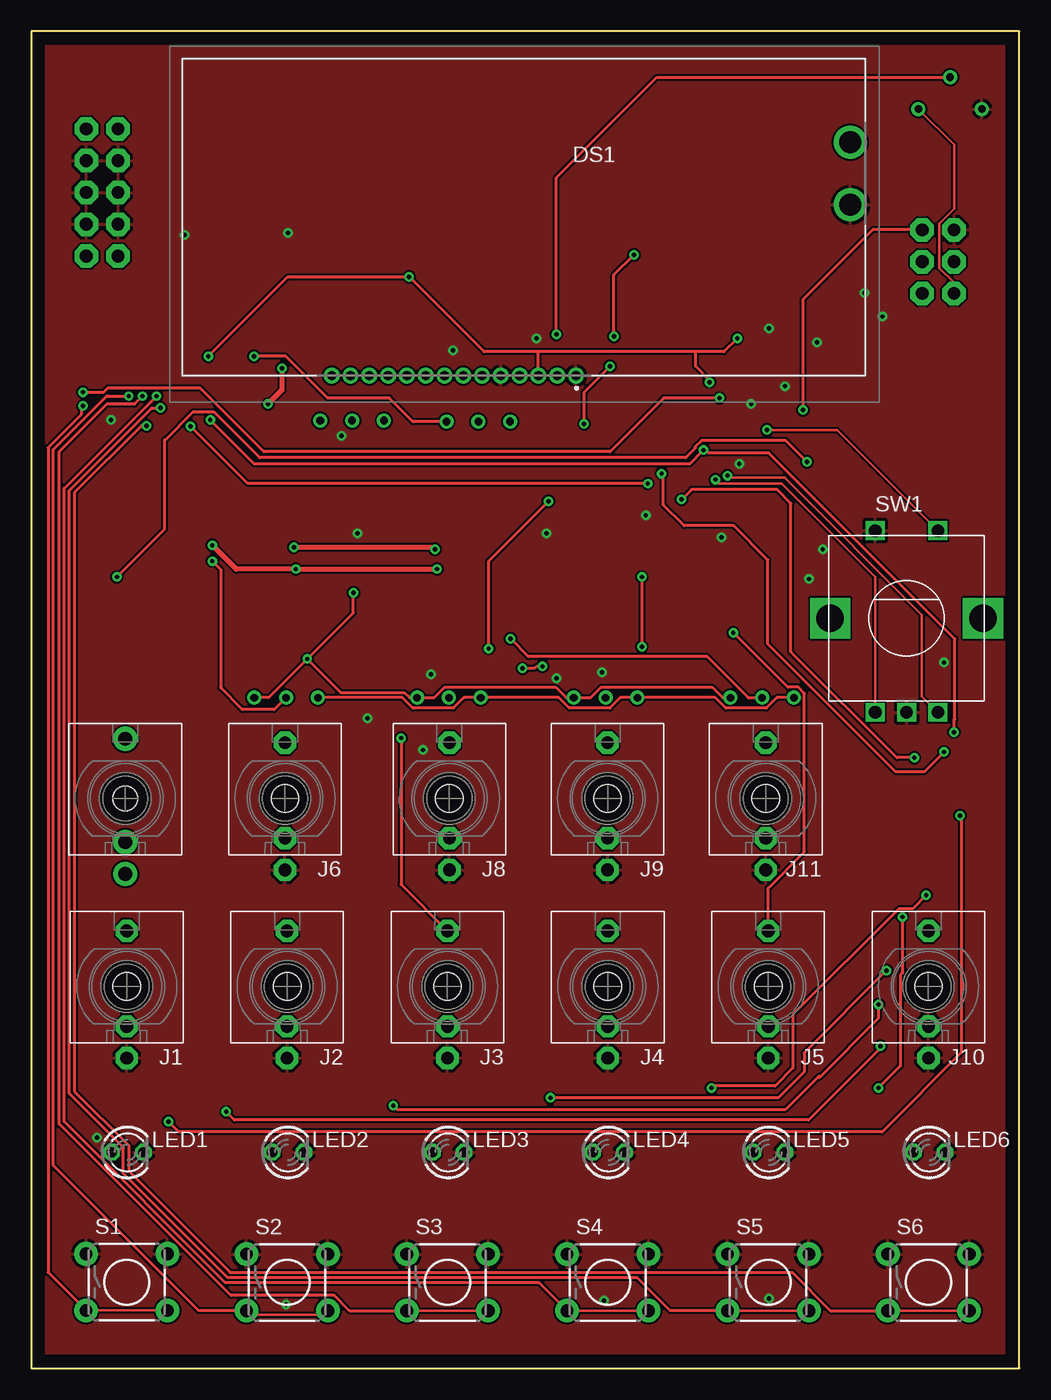
[diagram p4: board, top side]
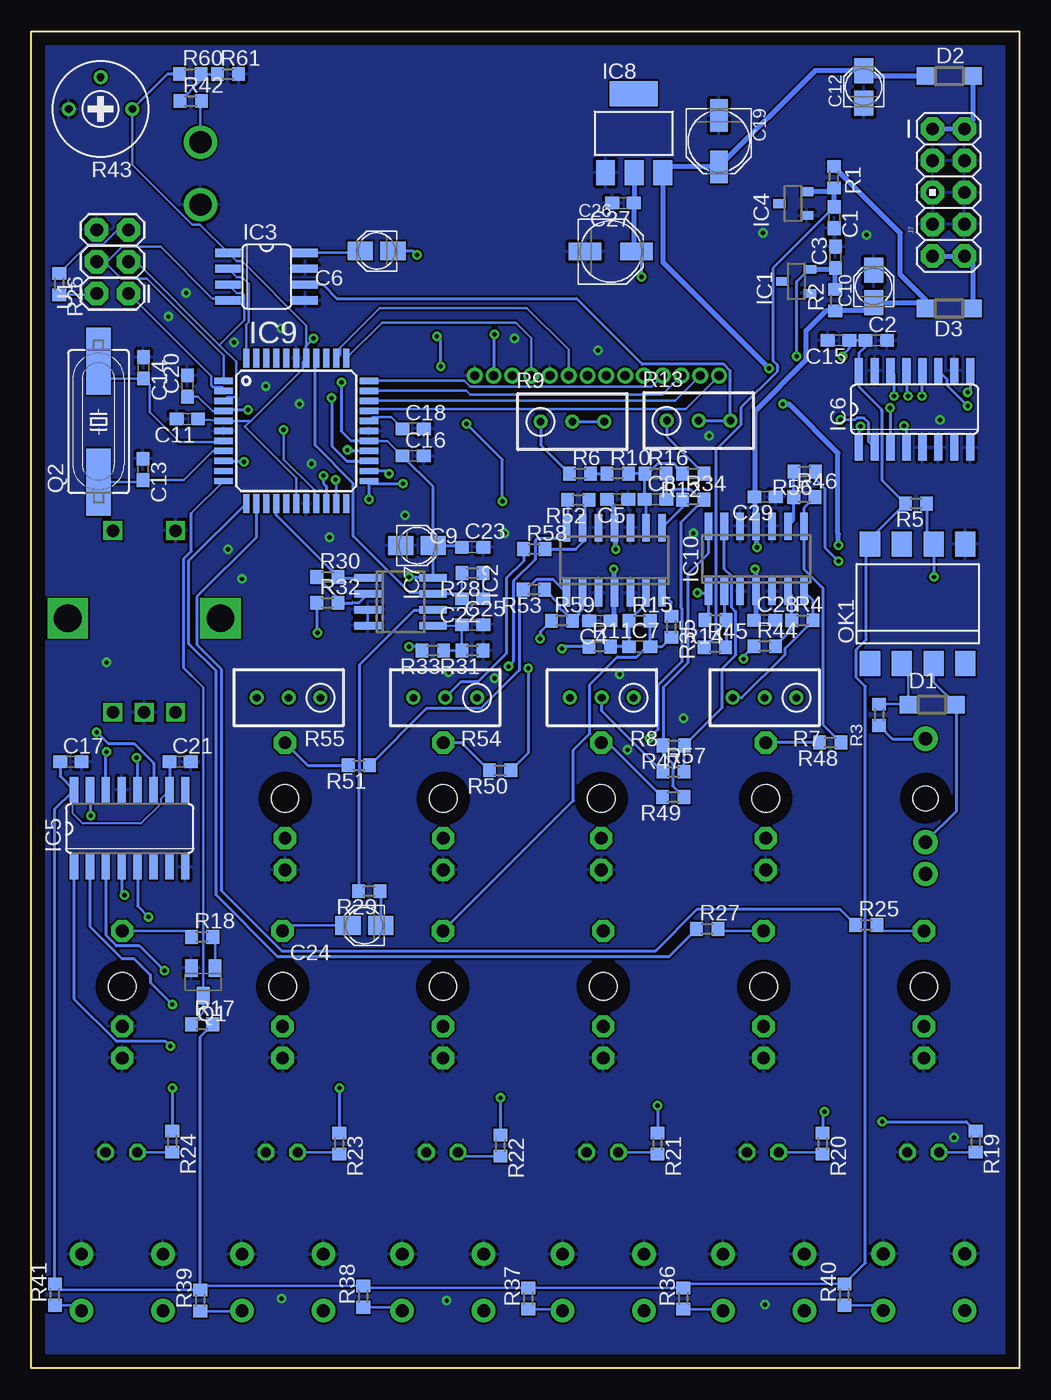
[diagram p5: board, bottom side, seen from below]

Size 78.88 x 106.76 mm. Coordinates in mm from the lower left corner, seen from the top.
Outline: 0,0 78.88,0 78.88,106.76 0,106.76 0,0
Copper layers (1*16): Top 0.035mm / dielectric 1.5mm / Bottom 0.035mm
Design rules "default": minimum track width 6mil, minimum drill 0.35mm, track to track 6mil, track to pad 6mil, pad to pad 6mil, via to via 6mil, smd to smd 6mil, copper to edge 40mil, drill to drill 6mil, minimum pad ring 10mil, minimum via ring 8mil, stop-mask expansion 4mil, vias tented up to drill 0mil, thermal gap 10mil

### Footprints (pad centres in the part's own frame; a part is rotated, then mirrored left to right if it is on the bottom)
C0603 = smd 1.1 x 1: 1 -0.85,0; 2 0.85,0
PANASONIC_A = smd 2 x 1.5: + 1.3,0; - -1.3,0
PANASONIC_C = smd 2.6 x 1.4: + 2.05,0; - -2.05,0
SOD123 = smd 1.4 x 1.4: A 1.9,0; C -1.9,0
NHDC0216AZFSWGBW = drill 0.74 pad 1.269: 1 4.111,-12.1; 2 2.611,-12.1; 3 1.111,-12.1; 4 -0.389,-12.1; 5 -1.889,-12.1; 6 -3.389,-12.1; 7 -4.889,-12.1; 8 -6.389,-12.1; 9 -7.889,-12.1; 10 -9.389,-12.1; 11 -10.889,-12.1; 12 -12.389,-12.1; 13 -13.889,-12.1; 14 -15.389,-12.1 | drill 1.77 pad 2.655: 15 26.011,6.55; 16 26.011,1.55
DBZ_R-PDSO-G3 = smd 0.7 x 1: 1 -0.95,-1.1; 2 0.95,-1.1; 3 0,1.1
SO14 = smd 0.6 x 2.2: 1 -3.81,-2.6; 2 -2.54,-2.6; 3 -1.27,-2.6; 4 0,-2.6; 5 1.27,-2.6; 6 2.54,-2.6; 7 3.81,-2.6; 8 3.81,2.6; 9 2.54,2.6; 10 1.27,2.6; 11 0,2.6; 12 -1.27,2.6; 13 -2.54,2.6; 14 -3.81,2.6
SO08 = smd 0.66 x 2.032: 1 -1.905,-3.073; 2 -0.635,-3.073; 3 0.635,-3.073; 4 1.905,-3.073; 5 1.905,3.073; 6 0.635,3.073; 7 -0.635,3.073; 8 -1.905,3.073
SO16 = smd 0.66 x 2.032: 1 -4.445,-3.073; 2 -3.175,-3.073; 3 -1.905,-3.073; 4 -0.635,-3.073; 5 0.635,-3.073; 6 1.905,-3.073; 7 3.175,-3.073; 8 4.445,-3.073; 9 4.445,3.073; 10 3.175,3.073; 11 1.905,3.073; 12 0.635,3.073; 13 -0.635,3.073; 14 -1.905,3.073; 15 -3.175,3.073; 16 -4.445,3.073
SO08' = smd 0.6 x 2.2: 1 -1.905,-2.6; 2 -0.635,-2.6; 3 0.635,-2.6; 4 1.905,-2.6; 5 1.905,2.6; 6 0.635,2.6; 7 -0.635,2.6; 8 -1.905,2.6
SOT223 = smd 1.499 x 2.007: 1 -2.261,-3.15; 2 0.025,-3.15; 3 2.311,-3.15 | smd 3.81 x 2.007: 4 0,3.15
TQFP44 = smd 1.5 x 0.5: 1 -5.8,4; 2 -5.8,3.2; 3 -5.8,2.4; 4 -5.8,1.6; 5 -5.8,0.8; 6 -5.8,0; 7 -5.8,-0.8; 8 -5.8,-1.6; 9 -5.8,-2.4; 10 -5.8,-3.2; 11 -5.8,-4; 23 5.8,-4; 24 5.8,-3.2; 25 5.8,-2.4; 26 5.8,-1.6; 27 5.8,-0.8; 28 5.8,0; 29 5.8,0.8; 30 5.8,1.6; 31 5.8,2.4; 32 5.8,3.2; 33 5.8,4 | smd 0.5 x 1.5: 12 -4,-5.8; 13 -3.2,-5.8; 14 -2.4,-5.8; 15 -1.6,-5.8; 16 -0.8,-5.8; 17 0,-5.8; 18 0.8,-5.8; 19 1.6,-5.8; 20 2.4,-5.8; 21 3.2,-5.8; 22 4,-5.8; 34 4,5.8; 35 3.2,5.8; 36 2.4,5.8; 37 1.6,5.8; 38 0.8,5.8; 39 0,5.8; 40 -0.8,5.8; 41 -1.6,5.8; 42 -2.4,5.8; 43 -3.2,5.8; 44 -4,5.8
WQP_PJ_301M6 = drill 1.016 pad 1.778 octagon: P1 0,-5.715; P2 0,-3.175; P3 0,4.445 | hole 2.2: 0,0
AVR_ICSP = drill 1.016 pad 1.88 octagon: 1 -1.27,5.08; 2 1.27,5.08; 3 -1.27,2.54; 4 1.27,2.54; 5 -1.27,0; 6 1.27,0; 7 -1.27,-2.54; 8 1.27,-2.54; 9 -1.27,-5.08; 10 1.27,-5.08
LED3MM = drill 0.813 octagon: A -1.27,0; K 1.27,0
DIL8-SMD = smd 1.6 x 2: 1 -3.81,-4.77; 2 -1.27,-4.77; 3 1.27,-4.77; 4 3.81,-4.77; 5 3.81,4.77; 6 1.27,4.77; 7 -1.27,4.77; 8 -3.81,4.77
SOT23-BEC = smd 1 x 1.4: B -0.95,-1.1; C 0,1.1; E 0.95,-1.1
HC49UP = smd 5.334 x 1.93: 1 -4.826,0; 2 4.826,0
R0603 = smd 1 x 1.1: 1 -0.85,0; 2 0.85,0
RTRIM3296W = drill 0.61: 1 0,-2.54; 2 0,0; 3 0,2.54
RTRIM3339P = drill 0.61: 1 -2.54,0; 2 0,-2.54; 3 2.54,0
TACTILE-PTH = drill 1.016 pad 1.88: 1 -3.251,2.261; 2 3.251,2.261; 3 -3.251,-2.261; 4 3.251,-2.261
ALPS_EC12E_SW = drill 1 square: A -2.5,-7.5; B 2.5,-7.5; C 0,-7.5; D -2.5,7; E 2.5,7 | drill 2.2 square: GND1 -6.1,0; GND2 6.1,0
2X3 = drill 1.016 pad 1.88 octagon: 1 0,0; 2 0,2.54; 3 2.54,0; 4 2.54,2.54; 5 5.08,0; 6 5.08,2.54
WQP_PJ_301M8 = drill 1.1 pad 1.93: P1 0,-6.032; P2 0,-3.493; P3 0,4.763 | hole 2: 0,0

### Placement (x,y rotation side)
C1  14.78,91.89 270 bottom
C2  11.43,82.07 0 bottom
C3  14.7,88.72 90 bottom
C4  33.5,59.69 180 bottom
C5  32.07,69.37 180 bottom
C6  51.31,89.22 180 bottom
C7  30.32,57.63 0 bottom
C8  29.05,69.37 0 bottom
C9  48.1,65.69 0 bottom
C10  11.64,86.38 90 bottom
C11  66.42,75.8 180 bottom
C12  12.44,102.33 90 bottom
C13  69.97,71.77 270 bottom
C14  69.92,79.89 270 bottom
C15  14.45,82.07 180 bottom
C16  48.41,72.84 0 bottom
C17  75.72,48.42 0 bottom
C18  48.4,75.03 0 bottom
C19  23.99,97.98 270 bottom
C20  66.43,78.43 90 bottom
C21  66.99,48.42 0 bottom
C22  43.66,61.44 180 bottom
C23  43.66,65.56 0 bottom
C24  52.3,35.35 180 bottom
C25  43.66,59.37 0 bottom
C26  32.62,89.17 0 bottom
C27  31.65,93.04 180 bottom
C28  20.34,59.72 0 bottom
C29  20.3,69.58 180 bottom
D1  6.96,52.99 0 bottom
D2  5.59,103.18 0 bottom
D3  5.61,84.63 180 bottom
DS1  39.37,91.36 0 top
IC1  17.81,86.79 90 bottom
IC2  32.33,64.51 0 bottom
IC3  60.09,87.17 270 bottom
IC4  18.06,93 90 bottom
IC5  71.03,43.1 0 bottom
IC6  8.38,76.57 0 bottom
IC7  MCP6002  [SO08']  49.41,61.2 270 bottom
IC8  30.78,98.61 0 bottom
IC9  57.73,74.85 0 bottom
IC10  21.02,64.64 0 bottom
J1  7.62,30.48 0 top
J2  20.42,30.48 0 top
J3  33.22,30.48 0 top
J4  46.02,30.48 0 top
J5  58.82,30.48 0 top
J6  20.25,45.5 0 top
J7  5.66,93.89 0 bottom
J8  33.38,45.5 0 top
J9  46,45.5 0 top
J10  71.62,30.48 0 top
J11  58.62,45.5 0 top
LED1  7.68,17.24 0 top
LED2  20.48,17.24 0 top
LED3  33.28,17.24 0 top
LED4  46.08,17.24 0 top
LED5  58.88,17.24 0 top
LED6  71.68,17.24 0 top
OK1  8.12,61.04 0 bottom
Q1  65.16,30.85 180 bottom
Q2  73.51,75.59 90 bottom
R1  14.81,95.12 270 bottom
R2  14.71,85.29 90 bottom
R3  11.21,52.17 90 bottom
R4  17.32,59.72 0 bottom
R5  8.26,69.06 180 bottom
R6  35.08,71.44 0 bottom
R7  20.34,53.55 90 bottom
R8  33.34,53.55 90 bottom
R9  35.69,75.59 270 bottom
R10  32.07,71.44 0 bottom
R11  33.5,57.63 0 bottom
R12  26.04,71.44 180 bottom
R13  25.61,75.67 270 bottom
R14  24.27,59.74 180 bottom
R15  30.32,59.69 0 bottom
R16  29.05,71.44 0 bottom
R17  65.25,27.46 0 bottom
R18  65.25,34.45 0 bottom
R19  3.49,18.1 270 bottom
R20  15.72,17.94 270 bottom
R21  28.89,17.94 270 bottom
R22  41.43,17.78 270 bottom
R23  54.29,17.94 270 bottom
R24  67.63,18.1 270 bottom
R25  12.22,35.4 0 bottom
R26  76.65,86.58 270 bottom
R27  24.92,35.08 0 bottom
R28  43.66,63.5 180 bottom
R29  51.91,38.1 180 bottom
R30  55.24,63.18 0 bottom
R31  43.66,57.31 180 bottom
R32  55.24,61.12 0 bottom
R33  46.83,57.31 180 bottom
R34  26.04,69.37 0 bottom
R35  27.78,59.21 270 bottom
R36  26.83,5.56 90 bottom
R37  39.21,5.56 90 bottom
R38  52.39,5.71 90 bottom
R39  65.41,5.4 90 bottom
R40  13.97,5.87 90 bottom
R41  76.99,5.87 90 bottom
R42  66.16,101.19 0 bottom
R43  73.35,100.55 180 bottom
R44  20.34,57.66 0 bottom
R45  24.31,57.58 0 bottom
R46  17.17,69.56 0 bottom
R47  27.6,49.73 180 bottom
R48  15.1,49.97 180 bottom
R49  27.64,45.61 180 bottom
R50  41.46,47.75 180 bottom
R51  52.73,48.15 180 bottom
R52  35.22,69.34 180 bottom
R53  38.76,62.19 180 bottom
R54  45.84,53.55 90 bottom
R55  58.34,53.55 90 bottom
R56  17.14,71.6 180 bottom
R57  27.62,47.62 0 bottom
R58  38.73,65.41 0 bottom
R59  36.51,59.69 0 bottom
R60  66.2,103.35 0 bottom
R61  63.18,103.35 0 bottom
S1  7.62,6.87 0 top
S2  20.42,6.85 0 top
S3  33.22,6.85 0 top
S4  46.02,6.85 0 top
S5  58.82,6.85 0 top
S6  71.62,6.85 0 top
SW1  69.87,59.88 0 top
U1  71.12,85.82 90 bottom
U$1  7.5,45.5 0 top

### Tracks (layer width: path | path; a pad name or v marks a point on that pad's centre or on a via)
5V_ACCURATE  (via drill 0.35)
  Top 0.254: v22.03,56.64 24.71,53.95 29.78,53.95 30.19,53.55 R8.1 32.16,53.55 32.99,54.39 41.85,54.39 42.69,53.55 R54.1 44.66,53.55 45.49,54.39 54.35,54.39 55.19,53.55 R55.1 | v22.03,56.64 18.94,53.55 R7.1 | v22.03,56.64 25.72,60.33 v25.72,61.91
  Bottom 0.254: R14.2 24.83,60.02 IC10.1 24.96,61.91 v25.72,61.91 | R44.1 22.03,56.82 v22.03,56.64
+5V  (via drill 0.35)
  Top 0.203: R43.1 73.66,97.7 73.66,92.59 72.47,91.39 72.47,87.87 73.66,86.67 U1.2
  Top 0.254: v56.36,82.23 55.29,81.17 53.02,81.17 | v54.13,78.74 54.13,78.9 53.02,80.01 53.02,81.17 | v14.13,80.8 20.48,87.15 v30.16,87.15 36.15,81.17 40.48,81.17 | 53.02,81.17 40.48,81.17 | DS1.3 40.48,81.17 | 40.48,81.17 | v48.74,63.18 v48.74,57.63
  Bottom 0.152: IC5.10 68.57,45.47 68.57,45.07 70.14,43.5 74.77,43.5 75.59,44.32 75.59,46.06
  Bottom 0.203: C11.1 IC9.5 61.37,75.65 | R26.2 73.75,85.73 U1.2 | 70.17,101.19 R43.1 70.81,96.1 66.04,91.33 65.42,91.33 IC3.1 62.48,88.39 62.05,88.39 56.93,83.27 IC9.38 57.23,80.35 57.23,79.8 61.37,75.65 | R40.2 26.51,6.72 R36.2 R37.2 52.23,6.41 R38.2 65.09,6.57 R39.2 76.52,6.25 R41.2 | 61.37,75.65 61.84,75.18 57.73,71.06 IC9.17 | IC7.8 46.81,63.18 | C9.+ | IC9.27 50.47,74.05 C16.1
  Bottom 0.254: C26.+ 30.16,88.77 v30.16,87.15 | R60.1 68.01,103.35 70.17,101.19 | C17.1 76.57,47.28 IC5.16 75.59,46.06 76.99,44.66 R41.2 | C21.1 67.84,46.19 IC5.10 | R39.2 65.41,26.45 R17.2 | C16.1 46.8,70.39 C9.+ 44.63,65.69 C23.1 | IC9.38 56.93,81.66 v56.36,82.23 | v54.13,78.74 54.15,78.72 54.15,74.84 53.36,74.05 IC9.27 | R40.2 12.29,8.4 12.29,54.44 13.01,55.16 13.01,57.39 12.22,58.17 12.22,65.52 OK1.8 11.93,66.23 R5.2 10.94,70.89 10.94,76.37 10.98,76.4 10.98,76.54 12.8,78.36 12.8,79.62 IC6.16 12.82,81.06 12.28,81.6 C2.1 C15.1 13.6,81.44 14.13,80.91 v14.13,80.8 | v48.74,63.18 46.81,63.18 | IC7.8 C9.+ | R33.2 48,57.63 v48.74,57.63
  Bottom 0.406: IC8.2 30.75,93.08 C27.1 30.8,89.4 C26.+
-5V_ACCURATE
  Top 0.254: R55.3 59.53,53.55 58.69,52.71 55.45,52.71 54.62,53.55 R54.3 47.03,53.55 46.19,52.71 42.95,52.71 42.12,53.55 R8.3 34.53,53.55 33.69,52.71 30.45,52.71 29.62,53.55 R7.3
  Bottom 0.254: IC10.7 16.48,61.3 R4.2 18.71,57.48 18.71,56.99 22.16,53.55 R7.3
ADC
  Bottom 0.203: R28.2 C22.2
  Bottom 0.254: C22.2 44.91,61.84 IC7.7 46.89,61.92 48.65,61.92 53.18,66.45 53.18,70.65 53.23,70.7 56.19,73.66 56.2,73.66 56.2,80.58 IC9.37
CLOCK_OUT
  Bottom 0.254: IC9.13 60.93,66.33 65.66,61.6 65.66,57.78 63.73,55.85 63.73,38.17 58.9,33.34 29.05,33.34 25.72,36.67 14.34,36.67 R25.1
DAC_CV
  Bottom 0.254: R13.2 R13.3 23.07,78.88 | IC3.6 55.59,86.53 54.48,85.42 35.36,85.42 30.11,80.17 23.6,80.17 23.07,79.64 23.07,78.88 | 23.07,78.88
DAC_TONE
  Bottom 0.203: IC3.8 52.75,89.07 C6.+
ENC_A  (via drill 0.35)
  Top 0.203: SW1.A 67.37,63.17 59.9,70.64 54.93,70.64 v54.61,70.96
  Bottom 0.203: IC9.21 54.53,71.04 v54.61,70.96
ENC_B  (via drill 0.35)
  Top 0.203: v55.56,71.28 55.72,71.12 60.14,71.12 71.1,60.16 71.1,53.65 SW1.B
  Bottom 0.254: v55.56,71.28 55.56,70.64 55.33,70.41 IC9.20
ENC_CLICK  (via drill 0.35)
  Top 0.203: v58.74,74.93 64.32,74.93 SW1.E
  Bottom 0.203: IC9.19 56.27,69.19 56.27,70.11 58.74,72.58 v58.74,74.93
GATE_IN
  Bottom 0.203: R17.1 65.16,28.41 Q1.C 65.16,54.36 66.11,55.31 | 66.11,68.27 IC9.11
  Bottom 0.254: 66.11,68.27 66.11,65.25 66.7,64.66 66.7,55.9 66.11,55.31
GATE_OUT
  Bottom 0.254: R27.1 28,32.86 59.21,32.86 64.14,37.78 64.14,55.68 66.29,57.84 66.29,64.49 IC9.12
GND  (via drill 0.35)
  Bottom 0.203: IC7.3 IC7.4
  other vias: 33.66,81.28 40.32,82.23 57.47,76.99 60.17,78.42 6.35,75.72 62.07,63.02 63.18,65.41 72.87,56.36 56.52,72.23 55.09,66.36 49.05,68.1 24.77,74.45 58.9,5.56 45.72,5.4 20.32,5.08 5.24,18.41 67.94,83.98 66.52,85.88 62.71,81.92 26.83,51.91 31.91,55.4 31.27,49.37 41.91,55.09 20.48,90.65 12.22,90.49 58.9,83.03 45.56,55.56 41.12,66.67 26.04,66.67
  pour Bottom: 81.44,107.31 -0.64,107.31 -1.75,106.2 -1.75,-1.11 79.85,-1.11 80.01,-1.27 80.01,106.05 80.17,106.05
  pour Top: 80.8,107.31 80.8,-1.27 -1.75,-1.27 -1.91,-1.11 -1.91,107.47 -1.75,107.63 80.49,107.63
IO_ENABLE  (via drill 0.35)
  Top 0.254: v12.7,75.22 17.28,70.64 v49.21,70.64 | v51.91,69.37 52.7,70.17 59.53,70.17 60.64,69.06 60.64,57.2 69.09,48.76 v70.48,48.76
  Bottom 0.254: IC5.12 70.39,48.67 v70.48,48.76 | v51.91,69.37 51.91,70.83 IC9.23 51.72,70.64 v49.21,70.64 | v12.7,75.22 12.82,75.1 IC6.1
IO_INPUT  (via drill 0.35)
  Top 0.254: v4.13,77.95 5.78,77.95 6.12,78.29 13.47,78.29 18.57,73.18 46.2,73.18 50.48,77.47 v54.93,77.47
  Bottom 0.254: IC6.9 3.93,78.14 v4.13,77.95 | v54.93,77.47 54.88,77.42 54.88,73.61 53.72,72.45 IC9.25
IO_OUTPUT  (via drill 0.35)
  Top 0.254: v72.87,49.21 71.28,47.62 69.01,47.62 58.81,57.83 58.81,64.54 56.06,67.29 52.12,67.29 50.46,68.94 50.46,71.3 v50.32,71.44
  Bottom 0.254: IC5.14 72.94,49.14 v72.87,49.21 | v50.32,71.44 50.54,71.65 IC9.24
IO_SCK  (via drill 0.35)
  Top 0.254: v14.29,75.72 17.8,72.21 52.55,72.21 v53.66,73.32 53.82,73.32 54.05,73.09 58.87,73.09 73.72,58.24 73.72,51.83 73.66,51.77 v73.66,50.8
  Bottom 0.254: v53.66,73.32 53.63,73.3 51.98,73.3 IC9.26 | v14.29,75.72 13.13,75.72 12.97,75.88 12.43,75.88 12.04,75.5 12.04,73.99 IC6.2 | v73.66,50.8 72.73,49.87 70.67,49.87 69.12,48.33 IC5.11
LCD_DATA4
  Bottom 0.203: IC9.33 44.33,78.85 43.85,78.37 29.37,78.37 DS1.11
LCD_DATA5
  Bottom 0.203: IC9.32 44.16,78.05 43.85,77.74 28.5,77.74 DS1.12
LCD_DATA6
  Bottom 0.203: IC9.31 27.49,77.25 DS1.13
LCD_DATA7
  Bottom 0.203: IC9.30 51.77,76.45 51.61,76.61 26.63,76.61 DS1.14
LCD_ENABLE
  Bottom 0.203: IC9.35 54.23,80.95 54.23,81.5 51.07,84.67 39.33,84.67 35.98,81.32 DS1.6
LCD_RS
  Bottom 0.203: IC9.34 50.87,83.51 40.21,83.51 38.98,82.28 DS1.4
MIDI_IN  (via drill 0.35)
  Top 0.254: v61.91,72.39 60.21,74.09 53.5,74.09 53,73.59 53,73.48 52.23,72.71 18.23,72.71 14.56,76.38 12.93,76.38 10.67,74.13 10.64,74.13 10.64,66.99 v6.83,63.18
  Bottom 0.254: R5.1 7.41,66.37 OK1.6 6.85,63.2 v6.83,63.18 | IC9.9 61.97,72.45 v61.91,72.39
MISO
  Bottom 0.203: IC9.2 63.53,78.23 63.65,78.35 64.39,78.35 64.53,78.5 64.53,79.23 U1.1
MOSI
  Bottom 0.203: 73.04,88.36 U1.4 | IC9.1 63.53,80.87 69.67,87.01 71.69,87.01 73.04,88.36 | IC3.4 63.33,85.42 64.43,85.42 68.56,89.55 71.61,89.55 72.81,88.36 73.04,88.36
N$1  (via drill 0.35)
  Top 0.254: v67.63,29.05 67.63,27.94 62.88,23.2 62.88,23.34 60.18,20.64 29.21,20.64 v28.89,20.95
  Bottom 0.254: v67.63,29.05 69.38,30.8 69.38,31.41 70.69,32.72 71.64,32.72 74.2,35.28 IC5.2 | v28.89,20.95 R21.1
N$2  (via drill 0.35)
  Top 0.254: v71.44,37.78 70.35,36.69 69.26,36.69 60.8,28.23 60.8,23.97 59.37,22.54 54.45,22.54 v54.29,22.38
  Bottom 0.254: IC5.4 71.67,38.01 v71.44,37.78 | v54.29,22.38 R23.1
N$3
  Bottom 0.203: LED5.A 54.44,17.24 R23.2
N$4
  Bottom 0.203: Q2.1 70.13,70.76 C13.2 66.72,70.92 64.39,73.25 IC9.8
N$5
  Bottom 0.203: R18.1 66.57,34.92 J10.P3
N$6  (via drill 0.35)
  Top 0.254: J5.P3 58.82,38.33 61.72,41.23 61.72,53.9 61.23,54.39 60.39,54.39 v56.04,58.74
  Bottom 0.203: C24.+ 58.4,35.35 J5.P3
  Bottom 0.254: v56.04,58.74 56.04,61.06 R32.1
N$7
  Bottom 0.254: R3.1 10.14,50.26 U$1.P3
N$8
  Bottom 0.254: IC2.8 26.89,68.75 R34.1
N$9  (via drill 0.35)
  Top 0.203: S5.4 S5.3
  Top 0.254: S5.3 50.99,4.59 48.35,7.23 15.67,7.23 7.35,15.55 7.35,17.63 3.04,21.95 3.04,70.09 9.62,76.68 v10.32,76.68
  Bottom 0.203: R39.1 62.11,4.55 S5.4
  Bottom 0.254: v10.32,76.68 10.32,73.54 IC6.3
N$10
  Bottom 0.254: R35.1 27.78,61.17 IC2.7
N$11
  Bottom 0.203: R25.2 10.9,34.92 J1.P3
N$12  (via drill 0.35)
  Top 0.203: S6.4 S6.3
  Top 0.254: v9.21,75.25 8.77,75.25 3.44,69.92 3.44,22.12 7.76,17.8 7.76,15.75 15.88,7.64 60.75,7.64 63.8,4.59 S6.3
  Bottom 0.203: R41.1 75.31,5.02 S6.4
  Bottom 0.254: IC6.4 9.01,75.05 v9.21,75.25
N$13  (via drill 0.35)
  Top 0.203: S4.4 S4.3
  Top 0.254: S4.3 40.53,6.83 15.5,6.83 2.63,19.7 2.63,70.26 v10,77.63
  Bottom 0.203: R38.1 49.55,4.87 S4.4
  Bottom 0.254: v10,77.63 10,79.37 IC6.14
N$14
  Bottom 0.203: R27.2 23.91,34.92 J2.P3
N$15
  Bottom 0.254: IC2.2 34.87,60.61 35.18,60.31 35.18,60.18 R59.2 36.51,60.53 36.56,60.53 36.72,60.7 36.72,61 R53.1
N$16
  Bottom 0.203: 33.32,49.89 J8.P3
  Bottom 0.254: R49.2 32.78,49.89 33.32,49.89
N$17  (via drill 0.35)
  Top 0.254: v36.51,57.47 36.51,64.45 v41.27,69.22 | v44.13,75.41 44.13,77.95 v46.2,80.01 | v46.51,82.39 46.51,87.31 v48.1,88.9
  Bottom 0.254: R11.1 36.35,57.63 v36.51,57.47 | v41.27,69.22 41.27,72.55 v44.13,75.41 | v46.2,80.01 46.2,82.07 v46.51,82.39 | v48.1,88.9 48.42,89.22 C6.-
N$18
  Bottom 0.203: 20.22,49.97 J6.P3
  Bottom 0.254: R48.2 20.22,49.97
N$19
  Bottom 0.203: LED6.A R24.2
N$20
  Bottom 0.203: Q2.2 73.51,79.66 73.18,79.04 C14.2 69.41,78.53 69.41,76.33 67.04,73.96 63.62,73.96 IC9.7
N$21  (via drill 0.35)
  Top 0.254: v69.53,36.04 69.53,31.57 69.38,31.41 69.38,24.13 v67.63,22.38
  Bottom 0.254: IC5.5 70.39,36.9 v69.53,36.04 | v67.63,22.38 R24.1
N$22
  Bottom 0.203: C18.1 50.16,75.95 51.63,75.95 IC9.29
N$23
  Bottom 0.254: IC2.6 29.79,61.07 R15.1 C7.1 R11.2
N$24  (via drill 0.35)
  Top 0.203: S1.4 S1.3
  Top 0.254: v4.13,76.83 3.97,76.68 3.97,76.14 1.34,73.51 1.34,7.64 S1.3
  Bottom 0.203: R40.1 11.28,5.02 S1.4
  Bottom 0.254: IC6.11 5.81,78.99 5.81,78.52 5.65,78.35 5.64,78.35 v4.13,76.83
N$25
  Bottom 0.203: DS1.15 65.38,101.12 R42.2
N$26  (via drill 0.35)
  Top 0.254: v29.53,50.32 29.53,38.62 J3.P3
  Bottom 0.254: R16.2 C8.2 27.66,69.91 27.66,70.04 27.5,70.2 26.27,70.2 25.44,69.37 R34.2 27.04,67.52 27.04,60.77 26.95,60.68 26.95,56.42 28.86,54.51 28.86,50.99 v29.53,50.32
N$27
  Bottom 0.254: IC2.9 29.79,69.27 C8.1 R16.1 | R16.1 R10.2 | R16.1 29.65,71.44 28.82,72.27 27.59,72.27 27.42,72.1 27.42,71.97 R12.2
N$28
  Bottom 0.203: D1.C 8.86,53.02 | 8.86,53.02 8.86,55.75 OK1.2 | R3.2 8.86,53.02
N$29
  Bottom 0.254: R13.1 28.15,74.4 R12.1
N$30  (via drill 0.35)
  Top 0.254: v10.95,19.68 11.77,18.87 67.92,18.87 74.3,25.24 74.3,43.97 v74.14,44.13
  Bottom 0.254: R19.1 4.23,19.68 v10.95,19.68 | v74.14,44.13 74.14,46.11 IC5.15
N$31  (via drill 0.35)
  Top 0.254: v15.56,20.48 16.21,19.82 62.05,19.82 67.79,25.56 v67.79,25.72
  Bottom 0.254: IC5.1 75.47,29.51 72.1,26.14 68.2,26.14 v67.79,25.72 | v15.56,20.48 15.72,20.32 R20.1
N$32
  Bottom 0.254: R9.1 38.23,73.73 R6.1
N$33  (via drill 0.35)
  Top 0.254: v68.26,31.75 61.68,25.17 61.68,23.64 59.63,21.59 v41.43,21.59
  Bottom 0.254: v68.26,31.75 70.27,33.76 72.1,33.76 72.94,34.59 IC5.3 | v41.43,21.59 R22.1
N$34  (via drill 0.35)
  Top 0.254: R43.2 49.94,103.09 41.91,95.06 v41.91,82.55
  Bottom 0.254: DS1.2 41.91,79.33 v41.91,82.55
N$35
  Bottom 0.254: R6.2 R10.1
N$36
  Bottom 0.152: IC7.5 44.58,59.3 C25.1
  Bottom 0.203: C25.1 R31.2 R33.1
N$37
  Bottom 0.254: IC7.2 52.7,61.14 53.23,61.14 53.25,61.12 R32.2 54.4,61.48 R30.1
N$38
  Bottom 0.152: C22.1 43.13,61.44 43.86,60.71 46.67,60.71 IC7.6
  Bottom 0.203: R28.1 C22.1
  Bottom 0.254: IC7.6 46.87,60.51 48.34,60.51 52.69,56.17 52.69,47.16 52.76,47.09 R29.2
N$39
  Bottom 0.254: R49.1 27.69,46.51 27.69,48.29 28.45,49.05 R47.2 28.45,54.34 26.48,56.32 26.48,63.42 24.83,65.07 IC10.14
N$40
  Bottom 0.254: R29.1 51,38.04 C24.-
N$41  (via drill 0.35)
  Top 0.254: v40.8,56.04 40.32,56.04 40.16,55.88 v39.21,55.88
  Bottom 0.254: R52.2 36.07,67.19 IC2.14 37.02,66.23 38.5,66.23 38.66,66.07 38.66,64.58 40.39,62.85 40.39,56.45 v40.8,56.04 | v39.21,55.88 39.21,49.15 R50.1
N$42
  Bottom 0.203: LED1.A R19.2
N$43
  Bottom 0.203: LED2.A 15.87,17.24 R20.2
N$44
  Bottom 0.203: LED3.A 29.04,17.24 R21.2
N$45
  Bottom 0.203: R22.2 44.5,16.93 LED4.A
N$46
  Bottom 0.254: R56.2 18.02,71.58 R46.1 18.02,67.7 IC10.9
N$47
  Bottom 0.254: R46.2 17.21,68.67 IC10.8 17.21,63.83 15.7,62.31 15.7,51.42 R48.1
N$48
  Bottom 0.254: R57.2 26.75,47.65 R47.1 23.72,52.77 23.72,55.87 22.64,56.96 22.64,60.4 22.98,60.75 22.98,63.25 23.56,63.83 IC10.13
N$49
  Bottom 0.254: IC10.2 23.56,59.88 R14.1 23.42,57.62 R45.2
N$50
  Bottom 0.254: R44.2 18.18,58.97 R4.1 18.18,61.73 IC10.6
N$51
  Bottom 0.254: R58.2 35.4,65.41 34.77,66.04 34.77,67.01 IC2.13 34.69,67.3 34.69,69.02 R52.1
N$52  (via drill 0.35)
  Top 0.254: v14.45,64.45 15.1,63.8 15.1,54.34 16.85,52.59 19.39,52.59 R7.2
  Bottom 0.254: R56.1 16.3,70.99 15.54,70.23 15.54,65.54 v14.45,64.45
N$53
  Bottom 0.254: R50.2 44.5,49.95 J9.P3
N$54
  Bottom 0.254: J11.P3 56.83,48.15 R51.2
N$55
  Bottom 0.254: IC2.1 37.25,63.02 38.52,63.02 39.35,62.19 R53.2 39.93,61.87 39.93,55.74 42.95,52.71 47.31,52.71 R51.1
N$56
  Bottom 0.406: J7.1 J7.2 3.69,99.67 D2.A
N$57
  Bottom 0.254: R57.1 33.34,52.49 R8.2
N$58  (via drill 0.35)
  Top 0.254: v38.26,58.26 39.69,56.83 53.95,56.83 57.23,53.55 R55.2
  Bottom 0.254: R59.1 38.26,58.79 v38.26,58.26
N$59
  Bottom 0.254: R58.1 39.59,64.45 40.96,63.08 40.96,57.08 43.22,54.82 44.57,54.82 R54.2
N$60
  Bottom 0.254: R61.1 R60.2 65.35,102.85 R42.1
N$64
  Bottom 0.406: J7.9 J7.10 3.71,88.13 D3.C
N$66
  Bottom 0.203: Q1.B 64.2,34.26 R18.2
N$73
  Bottom 0.254: OK1.3 6.85,54.77 D1.A 5.06,44.45 U$1.P2
N$88  (via drill 0.35)
  Top 0.203: S2.4 23.35,4.27 17.49,4.27 S2.3
  Top 0.254: S2.3 13.36,4.59 1.75,16.2 1.75,73.34 6.03,77.63 v7.78,77.63
  Bottom 0.203: R36.1 23.79,4.71 S2.4
  Bottom 0.254: v7.78,77.63 7.74,77.67 IC6.12
N$90  (via drill 0.35)
  Top 0.203: S3.4 S3.3
  Top 0.254: v8.89,77.63 8.23,76.97 7.51,76.97 7.48,76.99 6.03,76.99 2.22,73.18 2.22,19.51 15.92,5.81 24.18,5.81 25.39,4.59 S3.3
  Bottom 0.203: R37.1 36.59,4.71 S3.4
  Bottom 0.254: IC6.13 9.01,77.75 v8.89,77.63
PITCH_DETECTOR
  Bottom 0.254: IC7.1 54.32,63.1 R30.2 59.33,68.12 IC9.15
REF_-4.096  (via drill 0.35)
  Top 0.254: R9.3 30.45,75.59 28.57,77.47 23.65,77.47 20.32,80.8 v17.78,80.8
  Bottom 0.254: R9.2 R9.3 | IC1.2 16.83,87.74 17.78,86.78 v17.78,80.8
  Bottom 0.406: R2.2 14.71,87.86 C3.1 14.83,87.74 IC1.2
REF_-5V
  Bottom 0.254: C1.1 19.69,87.84 19.69,80.46 19.34,80.12 19.34,79.58 22.23,76.69 22.23,75.32 24.25,73.3 24.25,58.48 R45.1
  Bottom 0.406: C1.1 14.81,92.76 R1.2 15.12,93.95 IC4.2
RESET  (via drill 0.35)
  Top 0.254: U1.5 67.15,90.9 61.59,85.34 v61.59,76.52
  Bottom 0.203: C20.1 65.61,77.58 64.39,76.45 IC9.4 | R26.1 74.37,89.71 73.17,89.71 71.97,90.9 U1.5
  Bottom 0.254: v61.59,76.52 63.46,76.52 IC9.4
SCK
  Bottom 0.203: IC9.3 63.23,77.55 62.67,77.55 62.53,77.69 62.53,80.37 63.87,81.71 | U1.3 70.52,88.36 63.87,81.71 | IC3.3 62.48,85.84 62.05,85.84 61.9,85.7 61.9,83.68 63.87,81.71
SS
  Bottom 0.203: IC3.2 62.48,87.11 62.05,87.11 61.54,86.61 61.54,83.53 61.73,83.34 IC9.44
TONE_OUT
  Bottom 0.254: C7.2 R15.2 | J4.P3 35.62,45.33 35.62,49.35 34.29,50.68 34.29,54.61 32.1,56.8 30.56,56.8 29.73,57.63 C7.2 | C7.2 28.52,57.63 R35.2
VCC  (via drill 0.35)
  Top 0.406: v20,79.85 20,78.11 v18.89,76.99 | v32.38,63.82 v21.11,63.82 16.35,63.82 v14.45,65.72
  Bottom 0.406: D2.C 11.99,103.18 C12.+ 16.3,103.63 C19.+ 28,95.93 IC8.3 28.47,88.32 v20,79.85 | C4.1 32.33,60 IC2.4 32.38,61.97 v32.38,63.82 | C28.1 21.02,59.89 IC10.4 21.02,63.73 v21.11,63.82 | v18.89,76.99 18.39,76.99 14.49,73.09 14.49,66.63 14.45,66.59 v14.45,65.72
VEE  (via drill 0.35)
  Top 0.406: v20.95,65.56 32.07,65.56 v32.23,65.41
  Bottom 0.406: R1.1 9.49,90.66 9.49,87.32 7.51,85.34 D3.A 7.96,85.08 C10.- 12.29,84.44 R2.1 15.44,84.44 17.05,82.83 17.05,80.5 21.15,76.4 C29.2 21.15,67.36 IC10.11 21.02,65.63 v20.95,65.56 | C5.2 32.44,68.9 32.44,67.22 IC2.11 32.23,67.01 v32.23,65.41